# EAGLE design Blueberry Pi 7.1 (EAGLE 6.4)

## Sheet 1 of 5: IO / LRADC / RTL8237BS / Touch / SPI Flash
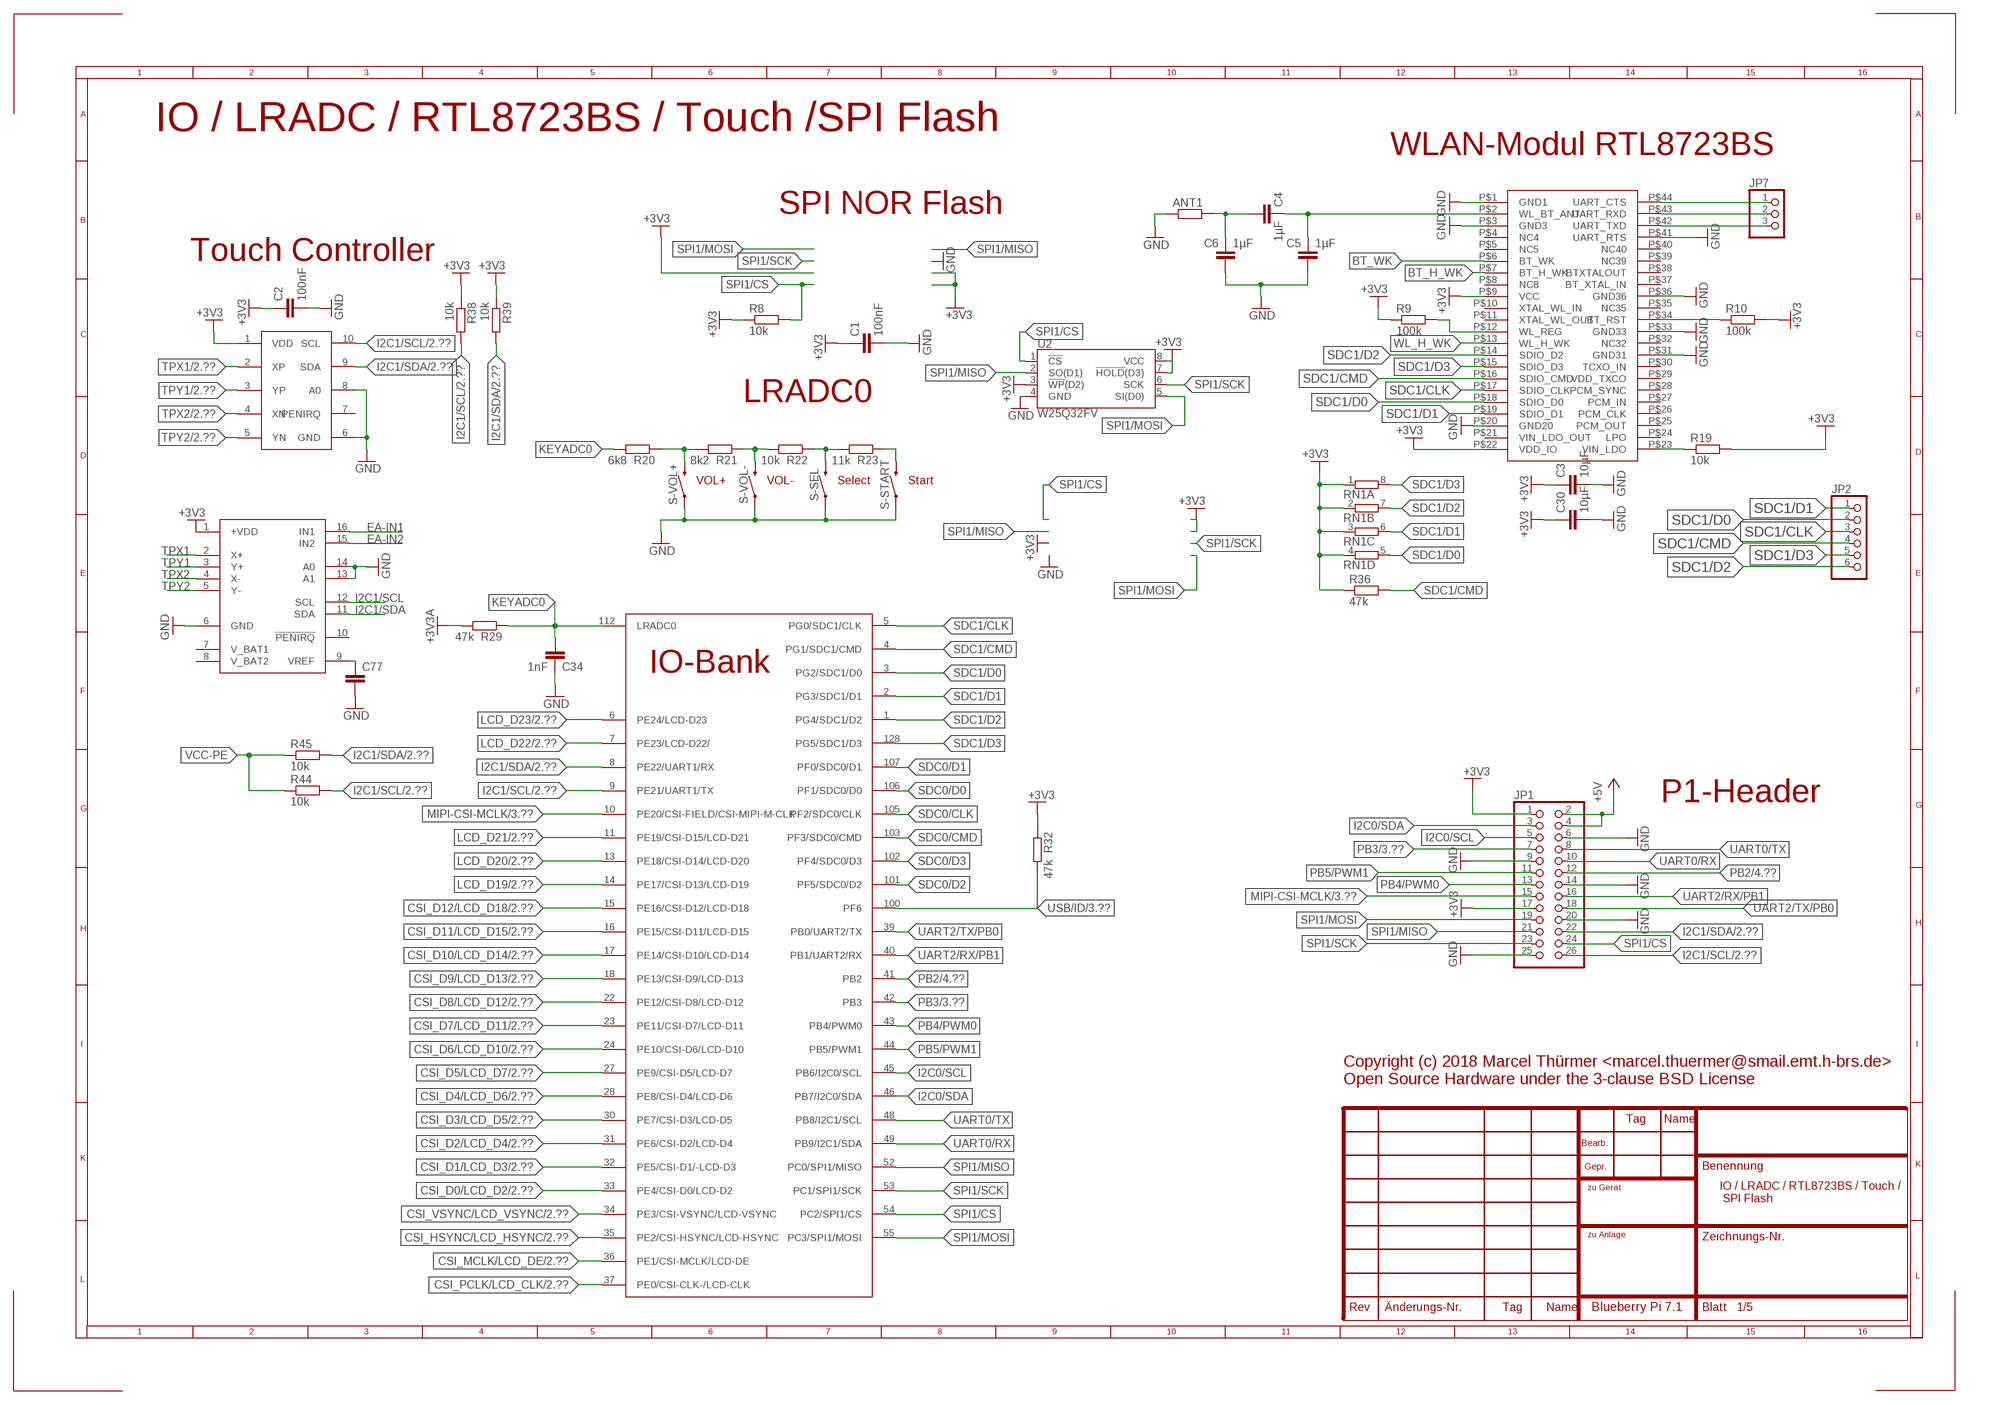
[diagram p0: schematic, sheet 1]

### Parts
ANT1  R-EU_R1206  [R1206]
C1  100nF  C-EUC0603  [C0603]
C2  100nF  C-EUC0603  [C0603]
C3  10µF  C-EUC0805  [C0805]
C4  1µF  C-EUC0603  [C0603]
C5  1µF  C-EUC0603  [C0603]
C6  1µF  C-EUC0603  [C0603]
C30  10µF  C-EUC0805  [C0805]
C34  1nF  C-EUC0603  [C0603]
C77  C-EUC0805  [C0805]
JP1  PINHD-2X13  [2X13]
JP2  PINHD-1X6_2.00  [1X06M]
JP7  PINHD-1X3M  [1X03M]
R8  10k  R-EU_R0603  [R0603]
R9  100k  R-EU_R0603  [R0603]
R10  100k  R-EU_R0603  [R0603]
R19  10k  R-EU_R0603  [R0603]
R20  6k8  R-EU_R0603  [R0603]
R21  8k2  R-EU_R0603  [R0603]
R22  10k  R-EU_R0603  [R0603]
R23  11k  R-EU_R0603  [R0603]
R29  47k  R-EU_R0603  [R0603]
R32  47k  R-EU_R0603  [R0603]
R36  47k  R-EU_R0603  [R0603]
R38  10k  R-EU_R0603  [R0603]
R39  10k  R-EU_R0603  [R0603]
R44  10k  R-EU_R0603  [R0603]
R45  10k  R-EU_R0603  [R0603]
RN1  4R-NEXB38V  [EXB38V]
S-SEL  SPARKFUN-SWITCHES_MOMENTARY-SWITCH-SPST-SMD-5.2-REDUNDANT  [SPARKFUN-SWITCHES_TACTILE_SWITCH_SMD_5.2MM]
S-START  SPARKFUN-SWITCHES_MOMENTARY-SWITCH-SPST-SMD-5.2-REDUNDANT  [SPARKFUN-SWITCHES_TACTILE_SWITCH_SMD_5.2MM]
S-VOL+  SPARKFUN-SWITCHES_MOMENTARY-SWITCH-SPST-SMD-5.2-REDUNDANT  [SPARKFUN-SWITCHES_TACTILE_SWITCH_SMD_5.2MM]
S-VOL-  SPARKFUN-SWITCHES_MOMENTARY-SWITCH-SPST-SMD-5.2-REDUNDANT  [SPARKFUN-SWITCHES_TACTILE_SWITCH_SMD_5.2MM]
U2  W25Q32FV  W25Q32FVSS  [SOIC-8]
U$1  V3S  [QFP-128]
U$2  RTL8723BS  [LGA]
U$7  TSC2003  [TSSOP16]
U$8  NS2009  [MSOP10]

### Nets
+3V3: C1.1 C2.1 C3.1 C30.1 JP1.1 JP1.17 R8.1 R9.1 R10.2 R19.2 R32.1 R36.1 R38.1 R39.1 RN1.1 RN1.2 RN1.3 RN1.4 U2.3(!WP!(D2)) U2.7(!HOLD!(D3)) U2.8(VCC) U$2.P$9(VCC) U$2.P$22(VDD_IO) U$7.1(+VDD) U$8.1(VDD) ; also sheet 2,3,4,5
+3V3A: R29.2 ; also sheet 3,4
+5V: JP1.2 JP1.4 ; also sheet 2,3,4
BT_H_WK: U$2.P$7(BT_H_WK)
BT_WK: U$2.P$6(BT_WK)
CSI_D0/LCD_D2: U$1.33(PE4/CSI-D0/LCD-D2) ; also sheet 2,5
CSI_D1/LCD_D3: U$1.32(PE5/CSI-D1/-LCD-D3) ; also sheet 2,5
CSI_D2/LCD_D4: U$1.31(PE6/CSI-D2/LCD-D4) ; also sheet 2,5
CSI_D3/LCD_D5: U$1.30(PE7/CSI-D3/LCD-D5) ; also sheet 2,5
CSI_D4/LCD_D6: U$1.28(PE8/CSI-D4/LCD-D6) ; also sheet 2,5
CSI_D5/LCD_D7: U$1.27(PE9/CSI-D5/LCD-D7) ; also sheet 2,5
CSI_D6/LCD_D10: U$1.24(PE10/CSI-D6/LCD-D10) ; also sheet 2,5
CSI_D7/LCD_D11: U$1.23(PE11/CSI-D7/LCD-D11) ; also sheet 2,5
CSI_D8/LCD_D12: U$1.22(PE12/CSI-D8/LCD-D12) ; also sheet 2,5
CSI_D9/LCD_D13: U$1.18(PE13/CSI-D9/LCD-D13) ; also sheet 2,5
CSI_D10/LCD_D14: U$1.17(PE14/CSI-D10/LCD-D14) ; also sheet 2,5
CSI_D11/LCD_D15: U$1.16(PE15/CSI-D11/LCD-D15) ; also sheet 2,5
CSI_D12/LCD_D18: U$1.15(PE16/CSI-D12/LCD-D18) ; also sheet 2,5
CSI_HSYNC/LCD_HSYNC: U$1.35(PE2/CSI-HSYNC/LCD-HSYNC) ; also sheet 2,5
CSI_MCLK/LCD_DE: U$1.36(PE1/CSI-MCLK/LCD-DE) ; also sheet 2,5
CSI_PCLK/LCD_CLK: U$1.37(PE0/CSI-CLK-/LCD-CLK) ; also sheet 2,5
CSI_VSYNC/LCD_VSYNC: U$1.34(PE3/CSI-VSYNC/LCD-VSYNC) ; also sheet 2,5
EA-IN1: U$7.16(IN1) ; also sheet 2
EA-IN2: U$7.15(IN2) ; also sheet 2
GND: ANT1.1 C1.2 C2.2 C3.2 C5.2 C6.2 C30.2 C34.1 C77.2 JP1.6 JP1.9 JP1.14 JP1.20 JP1.25 S-SEL.1 S-SEL.2 S-START.1 S-START.2 S-VOL+.1 S-VOL+.2 S-VOL-.1 S-VOL-.2 U2.4(GND) U$2.P$1(GND1) U$2.P$3(GND3) U$2.P$20(GND20) U$2.P$31(GND31) U$2.P$33(GND33) U$2.P$36(GND36) U$2.P$41(UART_RTS) U$7.6(GND) U$7.13(A1) U$7.14(A0) U$8.6(GND) U$8.8(A0) ; also sheet 2,3,4,5
I2C0/SCL: JP1.5 U$1.45(PB6/I2C0/SCL)
I2C0/SDA: JP1.3 U$1.46(PB7/I2C0/SDA)
I2C1/SCL: JP1.26 R38.2 R44.2 U$1.9(PE21/UART1/TX) U$7.12(SCL) U$8.10(SCL) ; also sheet 2,3
I2C1/SDA: JP1.22 R39.2 R45.2 U$1.8(PE22/UART1/RX) U$7.11(SDA) U$8.9(SDA) ; also sheet 2,3
KEYADC0: C34.2 R20.2 R29.1 U$1.112(LRADC0)
LCD_D19: U$1.14(PE17/CSI-D13/LCD-D19) ; also sheet 2,5
LCD_D20: U$1.13(PE18/CSI-D14/LCD-D20) ; also sheet 2,5
LCD_D21: U$1.11(PE19/CSI-D15/LCD-D21) ; also sheet 2,5
LCD_D22: U$1.7(PE23/LCD-D22/) ; also sheet 2,5
LCD_D23: U$1.6(PE24/LCD-D23) ; also sheet 2,5
MIPI-CSI-MCLK: JP1.15 U$1.10(PE20/CSI-FIELD/CSI-MIPI-M-CLK) ; also sheet 3
N$4: R19.1 U$2.P$23(VIN_LDO)
N$7: R9.2 U$2.P$12(WL_REG)
N$8: R20.1 R21.2 S-VOL+.3 S-VOL+.4
N$11: C77.1 U$7.9(VREF)
N$12: R10.1 U$2.P$34(BT_RST)
N$13: C4.1 C5.1 U$2.P$2(WL_BT_ANT)
N$14: ANT1.2 C4.2 C6.1
N$41: R21.1 R22.2 S-VOL-.3 S-VOL-.4
N$42: R22.1 R23.2 S-SEL.3 S-SEL.4
N$43: R23.1 S-START.3 S-START.4
N$61: JP7.1 U$2.P$44(UART_CTS)
N$62: JP7.2 U$2.P$43(UART_RXD)
N$63: JP7.3 U$2.P$42(UART_TXD)
PB2: JP1.12 U$1.41(PB2) ; also sheet 4
PB3: JP1.7 U$1.42(PB3) ; also sheet 3
PB4/PWM0: JP1.13 U$1.43(PB4/PWM0)
PB5/PWM1: JP1.11 U$1.44(PB5/PWM1)
SDC0/CLK: U$1.105(PF2/SDC0/CLK) ; also sheet 3
SDC0/CMD: U$1.103(PF3/SDC0/CMD) ; also sheet 3
SDC0/D0: U$1.106(PF1/SDC0/D0) ; also sheet 3
SDC0/D1: U$1.107(PF0/SDC0/D1) ; also sheet 3
SDC0/D2: U$1.101(PF5/SDC0/D2) ; also sheet 3
SDC0/D3: U$1.102(PF4/SDC0/D3) ; also sheet 3
SDC1/CLK: JP2.3 U$1.5(PG0/SDC1/CLK) U$2.P$17(SDIO_CLK)
SDC1/CMD: JP2.4 R36.2 U$1.4(PG1/SDC1/CMD) U$2.P$16(SDIO_CMD)
SDC1/D0: JP2.2 RN1.5 U$1.3(PG2/SDC1/D0) U$2.P$18(SDIO_D0)
SDC1/D1: JP2.1 RN1.6 U$1.2(PG3/SDC1/D1) U$2.P$19(SDIO_D1)
SDC1/D2: JP2.6 RN1.7 U$1.1(PG4/SDC1/D2) U$2.P$14(SDIO_D2)
SDC1/D3: JP2.5 RN1.8 U$1.128(PG5/SDC1/D3) U$2.P$15(SDIO_D3)
SPI1/CS: JP1.24 R8.2 U2.1(!CS!) U$1.54(PC2/SPI1/CS)
SPI1/MISO: JP1.21 U2.2(SO(D1)) U$1.52(PC0/SPI1/MISO)
SPI1/MOSI: JP1.19 U2.5(SI(D0)) U$1.55(PC3/SPI1/MOSI)
SPI1/SCK: JP1.23 U2.6(SCK) U$1.53(PC1/SPI1/SCK)
TPX1: U$7.2(X+) U$8.2(XP) ; also sheet 2
TPX2: U$7.4(X-) U$8.4(XN) ; also sheet 2
TPY1: U$7.3(Y+) U$8.3(YP) ; also sheet 2
TPY2: U$7.5(Y-) U$8.5(YN) ; also sheet 2
UART0/RX: JP1.10 U$1.49(PB9/I2C1/SDA)
UART0/TX: JP1.8 U$1.48(PB8/I2C1/SCL)
UART2/RX/PB1: JP1.16 U$1.40(PB1/UART2/RX)
UART2/TX/PB0: JP1.18 U$1.39(PB0/UART2/TX)
USB/ID: R32.2 U$1.100(PF6) ; also sheet 3
VCC-PE: R44.1 R45.1 ; also sheet 4
WL_H_WK: U$2.P$13(WL_H_WK)
Unconnected: U$2.P$4(NC4) U$2.P$5(NC5) U$2.P$8(NC8) U$2.P$10(XTAL_WL_IN) U$2.P$11(XTAL_WL_OUT) U$2.P$21(VIN_LDO_OUT) U$2.P$24(LPO) U$2.P$25(PCM_OUT) U$2.P$26(PCM_CLK) U$2.P$27(PCM_IN) U$2.P$28(PCM_SYNC) U$2.P$29(VDD_TXCO) U$2.P$30(TCXO_IN) U$2.P$32(NC32) U$2.P$35(NC35) U$2.P$37(BT_XTAL_IN) U$2.P$38(BTXTALOUT) U$2.P$39(NC39) U$2.P$40(NC40) U$7.7(V_BAT1) U$7.8(V_BAT2) U$7.10(!PENIRQ) U$8.7(PENIRQ)

### Notes on the sheet
- IO / LRADC / RTL8723BS / Touch /SPI Flash
- WLAN-Modul RTL8723BS
- SPI NOR Flash
- Touch Controller
- LRADC0
- VOL+ | VOL- | Select | Start
- P1-Header
- Copyright (c) 2018 Marcel Thürmer <marcel.thuermer@smail.emt.h-brs.de>
  Open Source Hardware under the 3-clause BSD License
- IO / LRADC / RTL8723BS / Touch /
   SPI Flash

## Sheet 2 of 5: LCD FFC / Camera FFC / Camera Header (OV7670, OV2640)
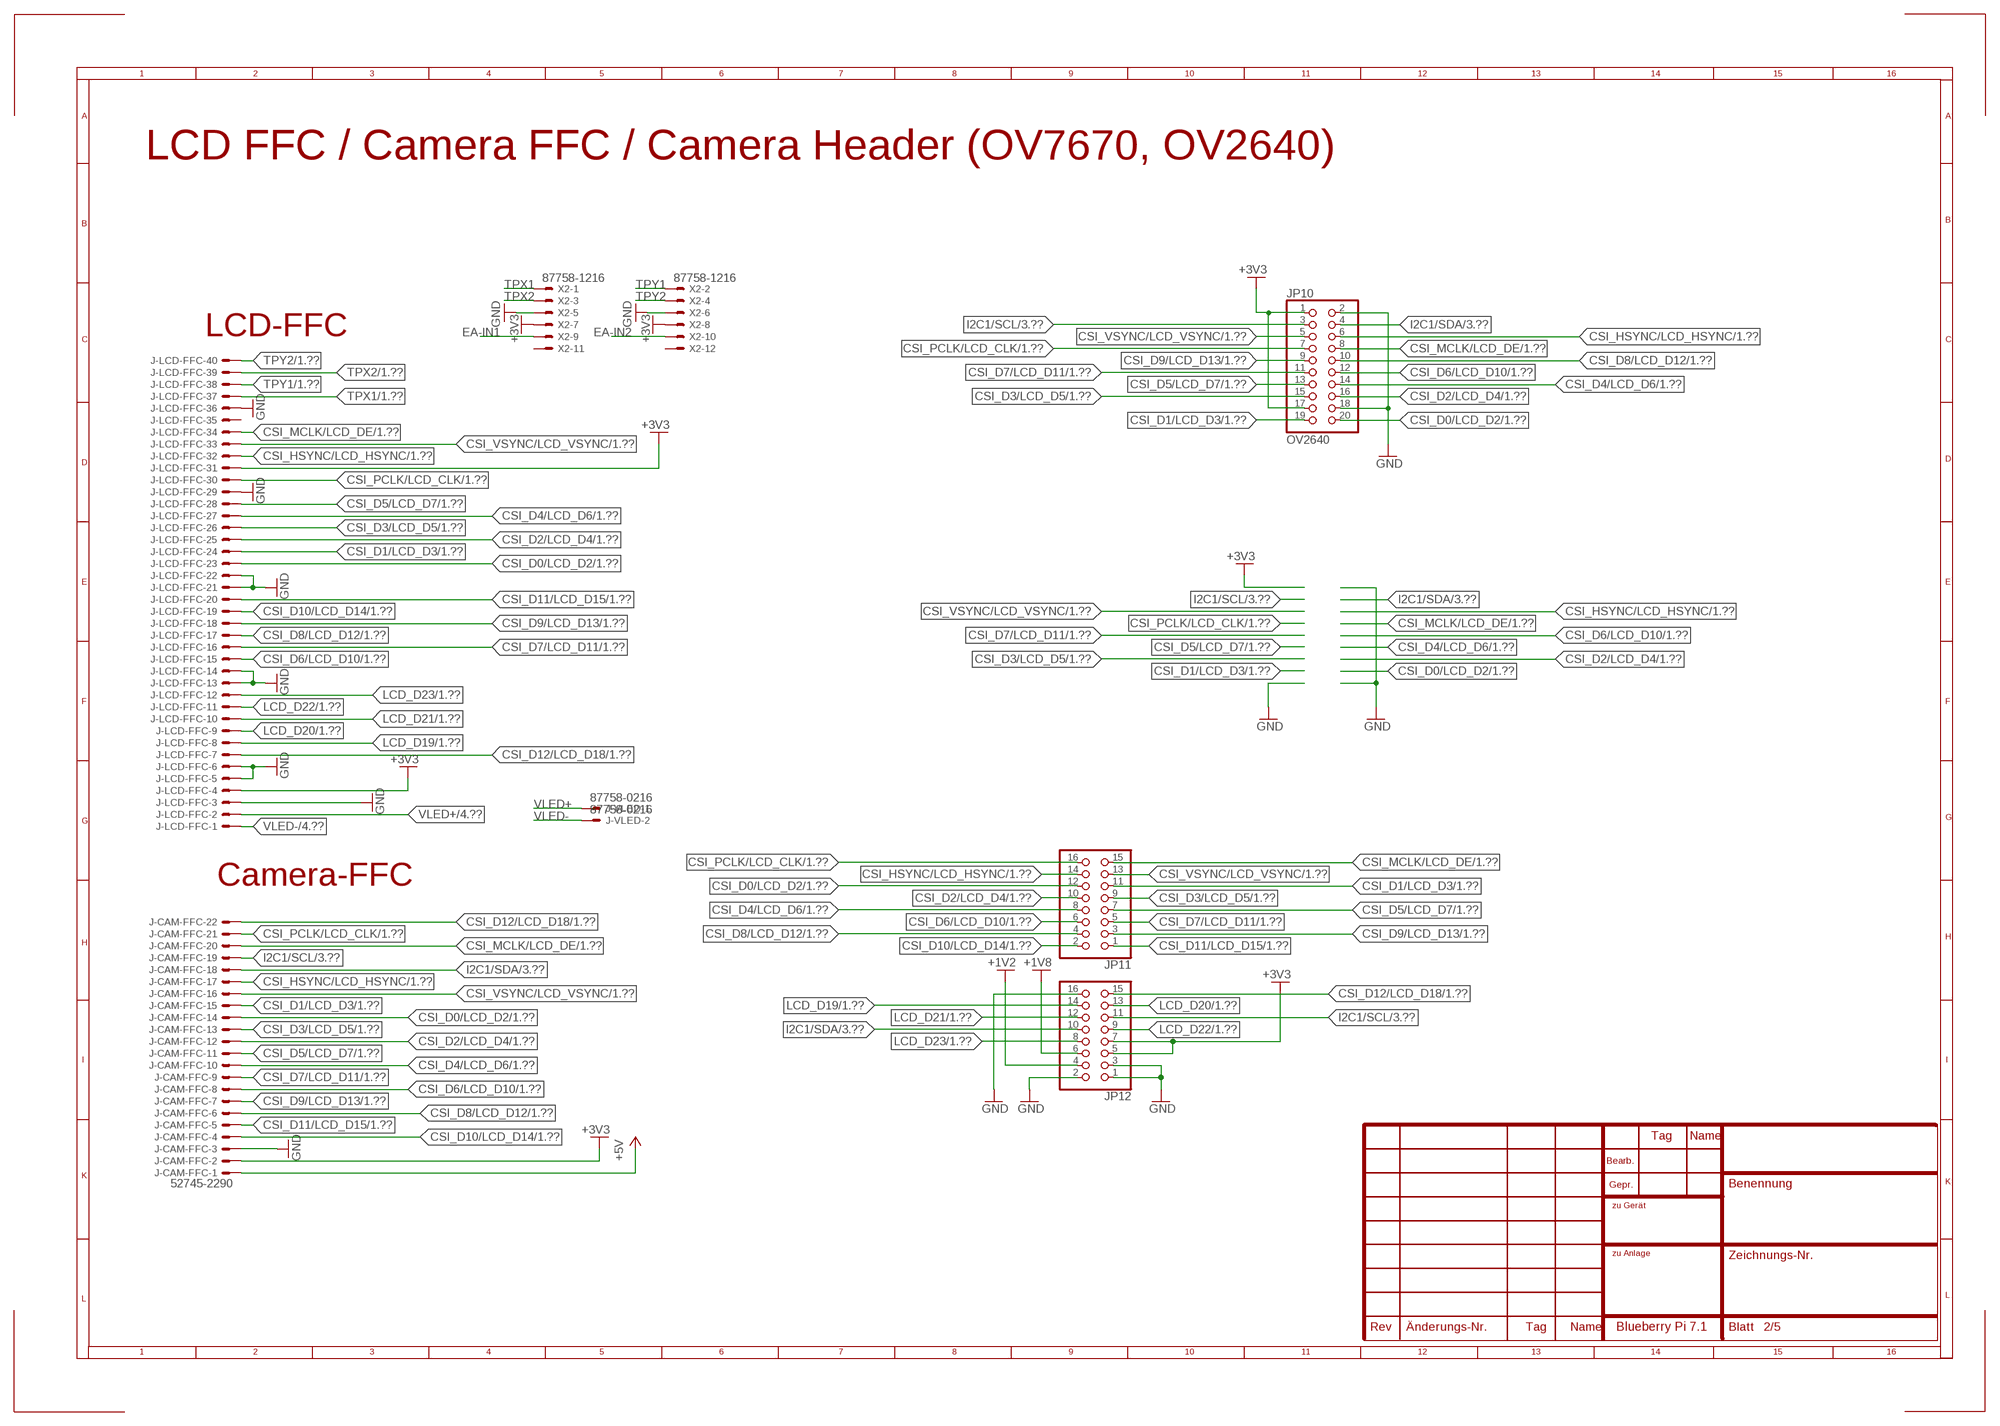
[diagram p1: schematic, sheet 2]

### Parts
J-CAM-FFC  52745-2290  [52745-2290]
J-LCD-FFC  40PINFPCH15-1LW  [XF2H-4015-1LW]
J-VLED  87758-0216  [87758-0216]
JP10  OV2640  PINHD-2X10  [2X10]
JP11  PINHD-2X8M  [2X08M]
JP12  PINHD-2X8M  [2X08M]
X2  87758-1216  [87758-1216]

### Nets
+1V2: JP12.4 ; also sheet 4
+1V8: JP12.6 ; also sheet 4
+3V3: J-CAM-FFC.2 J-LCD-FFC.4 J-LCD-FFC.31 JP10.1 JP10.17 JP12.5 JP12.7 X2.7 X2.8 ; also sheet 1,3,4,5
+5V: J-CAM-FFC.1 ; also sheet 1,3,4
CSI_D0/LCD_D2: J-CAM-FFC.14 J-LCD-FFC.23 JP10.20 JP11.12 ; also sheet 1,5
CSI_D1/LCD_D3: J-CAM-FFC.15 J-LCD-FFC.24 JP10.19 JP11.11 ; also sheet 1,5
CSI_D2/LCD_D4: J-CAM-FFC.12 J-LCD-FFC.25 JP10.16 JP11.10 ; also sheet 1,5
CSI_D3/LCD_D5: J-CAM-FFC.13 J-LCD-FFC.26 JP10.15 JP11.9 ; also sheet 1,5
CSI_D4/LCD_D6: J-CAM-FFC.10 J-LCD-FFC.27 JP10.14 JP11.8 ; also sheet 1,5
CSI_D5/LCD_D7: J-CAM-FFC.11 J-LCD-FFC.28 JP10.13 JP11.7 ; also sheet 1,5
CSI_D6/LCD_D10: J-CAM-FFC.8 J-LCD-FFC.15 JP10.12 JP11.6 ; also sheet 1,5
CSI_D7/LCD_D11: J-CAM-FFC.9 J-LCD-FFC.16 JP10.11 JP11.5 ; also sheet 1,5
CSI_D8/LCD_D12: J-CAM-FFC.6 J-LCD-FFC.17 JP10.10 JP11.4 ; also sheet 1,5
CSI_D9/LCD_D13: J-CAM-FFC.7 J-LCD-FFC.18 JP10.9 JP11.3 ; also sheet 1,5
CSI_D10/LCD_D14: J-CAM-FFC.4 J-LCD-FFC.19 JP11.2 ; also sheet 1,5
CSI_D11/LCD_D15: J-CAM-FFC.5 J-LCD-FFC.20 JP11.1 ; also sheet 1,5
CSI_D12/LCD_D18: J-CAM-FFC.22 J-LCD-FFC.7 JP12.15 ; also sheet 1,5
CSI_HSYNC/LCD_HSYNC: J-CAM-FFC.17 J-LCD-FFC.32 JP10.6 JP11.14 ; also sheet 1,5
CSI_MCLK/LCD_DE: J-CAM-FFC.20 J-LCD-FFC.34 JP10.8 JP11.15 ; also sheet 1,5
CSI_PCLK/LCD_CLK: J-CAM-FFC.21 J-LCD-FFC.30 JP10.7 JP11.16 ; also sheet 1,5
CSI_VSYNC/LCD_VSYNC: J-CAM-FFC.16 J-LCD-FFC.33 JP10.5 JP11.13 ; also sheet 1,5
EA-IN1: X2.9 ; also sheet 1
EA-IN2: X2.10 ; also sheet 1
GND: J-CAM-FFC.3 J-LCD-FFC.3 J-LCD-FFC.5 J-LCD-FFC.6 J-LCD-FFC.13 J-LCD-FFC.14 J-LCD-FFC.21 J-LCD-FFC.22 J-LCD-FFC.29 J-LCD-FFC.36 JP10.2 JP10.18 JP12.1 JP12.2 JP12.3 JP12.16 X2.5 X2.6 ; also sheet 1,3,4,5
I2C1/SCL: J-CAM-FFC.19 JP10.3 JP12.11 ; also sheet 1,3
I2C1/SDA: J-CAM-FFC.18 JP10.4 JP12.10 ; also sheet 1,3
LCD_D19: J-LCD-FFC.8 JP12.14 ; also sheet 1,5
LCD_D20: J-LCD-FFC.9 JP12.13 ; also sheet 1,5
LCD_D21: J-LCD-FFC.10 JP12.12 ; also sheet 1,5
LCD_D22: J-LCD-FFC.11 JP12.9 ; also sheet 1,5
LCD_D23: J-LCD-FFC.12 JP12.8 ; also sheet 1,5
TPX1: J-LCD-FFC.37 X2.1 ; also sheet 1
TPX2: J-LCD-FFC.39 X2.3 ; also sheet 1
TPY1: J-LCD-FFC.38 X2.2 ; also sheet 1
TPY2: J-LCD-FFC.40 X2.4 ; also sheet 1
VLED+: J-LCD-FFC.2 J-VLED.1 ; also sheet 4
VLED-: J-LCD-FFC.1 J-VLED.2 ; also sheet 4
Unconnected: J-LCD-FFC.35 X2.11 X2.12

### Notes on the sheet
- LCD FFC / Camera FFC / Camera Header (OV7670, OV2640)
- LCD-FFC
- Camera-FFC

## Sheet 3 of 5: Ethernet / USB Host / SDC0 / Audio / MIPI CSI
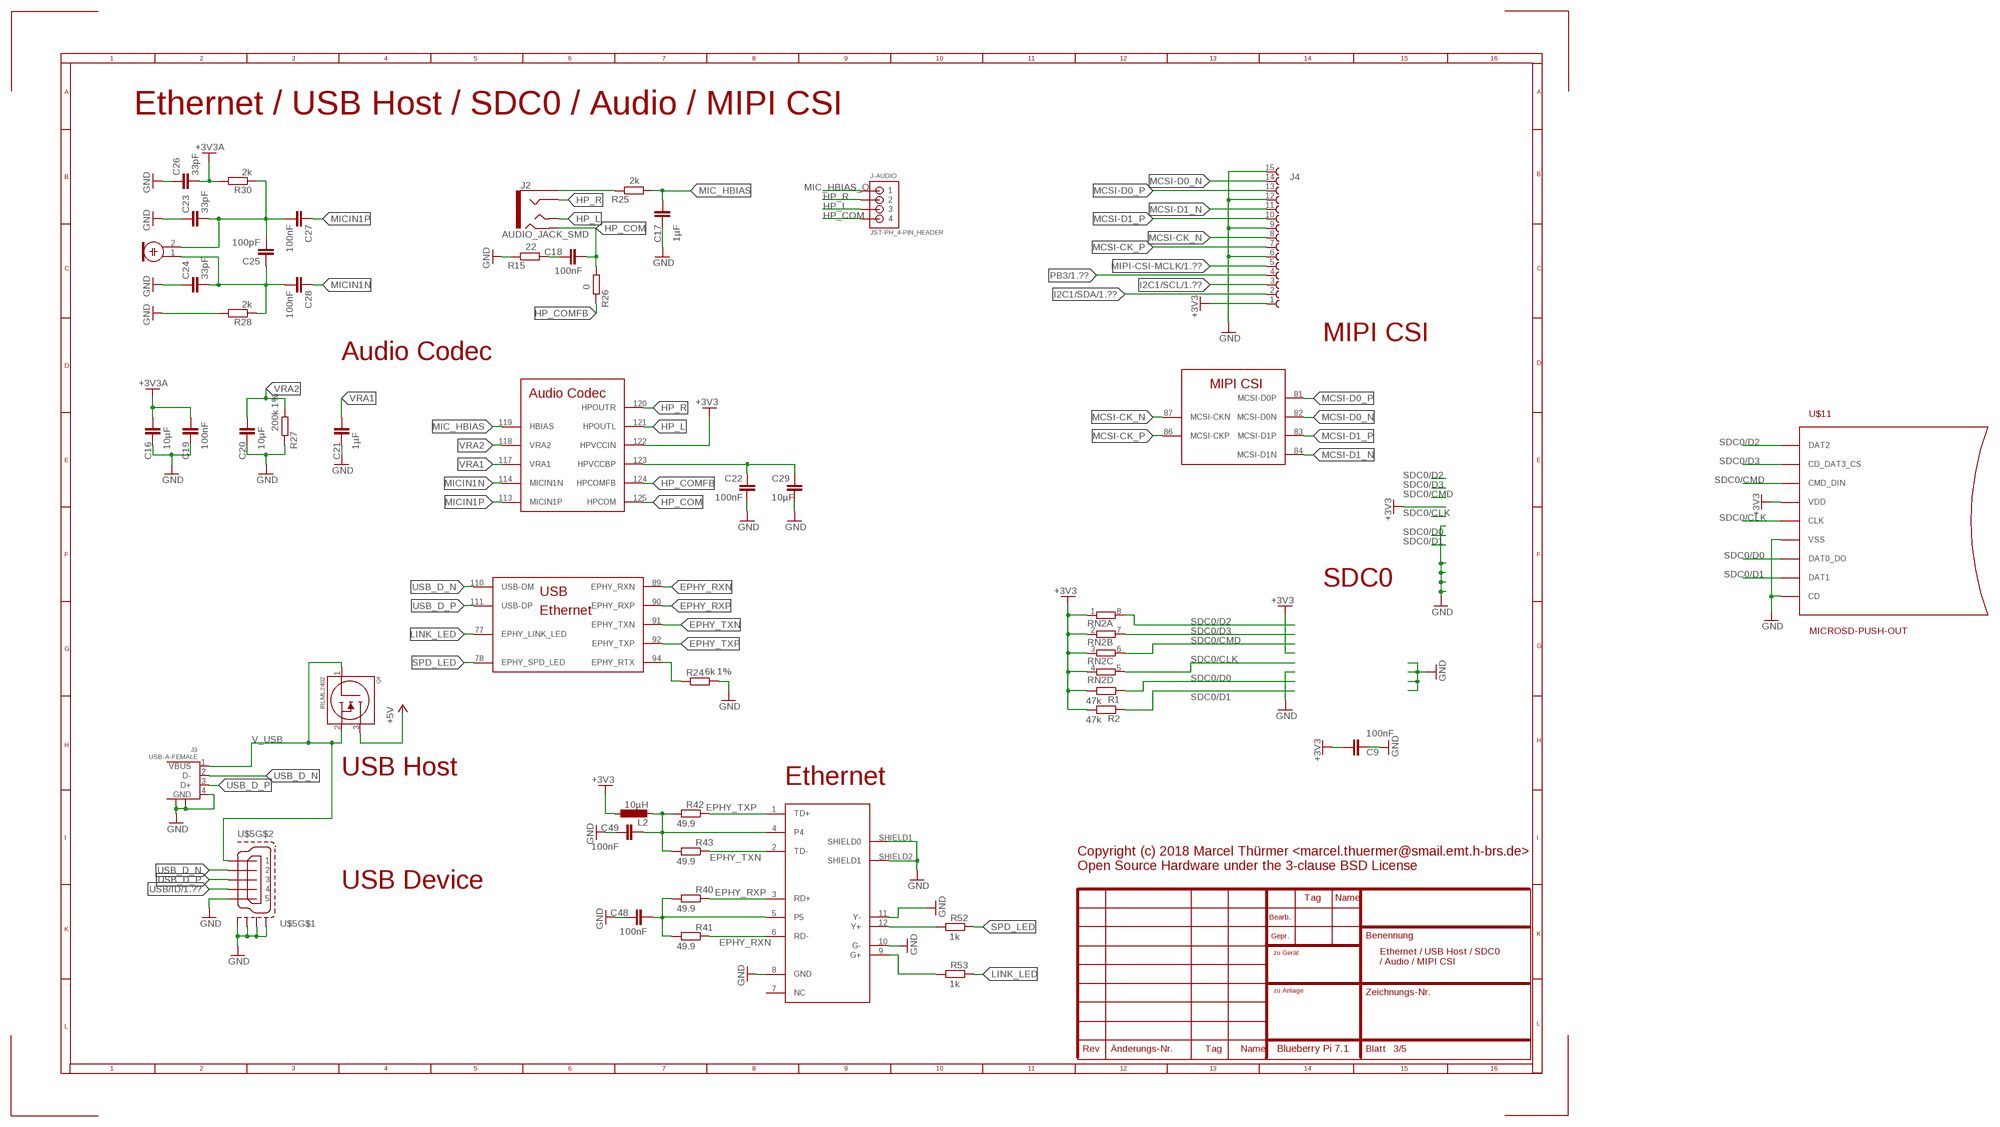
[diagram p2: schematic, sheet 3]

### Parts
C9  100nF  C-EUC0603  [C0603]
C16  10µF  C-EUC0805  [C0805]
C17  1µF  C-EUC0603  [C0603]
C18  100nF  C-EUC0603  [C0603]
C19  100nF  C-EUC0603  [C0603]
C20  10µF  C-EUC0805  [C0805]
C21  1µF  C-EUC0603  [C0603]
C22  100nF  C-EUC0603  [C0603]
C23  33pF  C-EUC0603  [C0603]
C24  33pF  C-EUC0603  [C0603]
C25  100pF  C-EUC0603  [C0603]
C26  33pF  C-EUC0603  [C0603]
C27  100nF  C-EUC0603  [C0603]
C28  100nF  C-EUC0603  [C0603]
C29  10µF  C-EUC0805  [C0805]
C48  100nF  C-EUC0603  [C0603]
C49  100nF  C-EUC0603  [C0603]
J2  AUDIO_JACK_SMD  AUDIO_JACK_TRRSSMD_RA  [AUDIO_JACK_3.5MM_TRRS_SMD_RA]
J3  USB-A-FEMALE  [USB-A-FEMALE]
J4  68611514122  [68611514122]
J-AUDIO  JST-PH_4-PIN_HEADER  [JST_B4B-PH_HEADER]
L2  10µH  L-EUL0805  [L0805]
MIC  ELECTRET_MICROPHON-F6035AP  [F6035AP]
Q4  IRLML2402  [SOT23]
R1  47k  R-EU_R0603  [R0603]
R2  47k  R-EU_R0603  [R0603]
R15  22  R-EU_R0603  [R0603]
R24  6k 1%  R-EU_R0603  [R0603]
R25  2k  R-EU_R0603  [R0603]
R26  0  R-EU_R0603  [R0603]
R27  200k 1%  R-EU_R0603  [R0603]
R28  2k  R-EU_R0603  [R0603]
R30  2k  R-EU_R0603  [R0603]
R40  49.9  R-EU_R0603  [R0603]
R41  49.9  R-EU_R0603  [R0603]
R42  49.9  R-EU_R0603  [R0603]
R43  49.9  R-EU_R0603  [R0603]
R52  1k  R-EU_R0603  [R0603]
R53  1k  R-EU_R0603  [R0603]
RN2  4R-NEXB38V  [EXB38V]
U$3  HR911105A  [RJ45]
U$5  MICRO-USB-SHIELD-ZX62R-B-5P  [ZX62R-B-5P]
U$11  MICROSD-PUSH-OUT  [MICROSD-PUSH-OUT]

### Nets
+3V3: C9.1 J4.1 L2.1 R1.2 R2.2 RN2.1 RN2.2 RN2.3 RN2.4 U$1.122(HPVCCIN) U$11.4(VDD) ; also sheet 1,2,4,5
+3V3A: C16.2 C19.2 C26.2 R30.2 ; also sheet 1,4
+5V: Q4.3(DRAIN) ; also sheet 1,2,4
EPHY_RXN: R41.1 U$1.89(EPHY_RXN) U$3.6(RD-)
EPHY_RXP: R40.1 U$1.90(EPHY_RXP) U$3.3(RD+)
EPHY_TXN: R43.1 U$1.91(EPHY_TXN) U$3.2(TD-)
EPHY_TXP: R42.1 U$1.92(EPHY_TXP) U$3.1(TD+)
GND: C9.2 C16.1 C17.2 C19.1 C20.1 C21.1 C22.2 C23.1 C24.1 C26.1 C29.1 C48.2 C49.2 J3.4(GND) J3.P$1 J3.P$2 J4.6 J4.9 J4.12 J4.15 R15.1 R24.2 R27.1 R28.2 U$3.8(GND) U$3.10(G-) U$3.11(Y-) U$3.SHIELD1(SHIELD0) U$3.SHIELD2(SHIELD1) U$5.5 U$5.M1(S1) U$5.M2(S2) U$5.M3(S3) U$5.M4(S4) U$11.6(VSS) U$11.CD U$11.G1(VSS) U$11.G2(VSS) U$11.G3(VSS) U$11.G4(VSS) ; also sheet 1,2,4,5
HP_COM: C18.2 J2.RING2 J-AUDIO.P4 R26.2 U$1.125(HPCOM)
HP_COMFB: R26.1 U$1.124(HPCOMFB)
HP_L: J2.TIP J-AUDIO.P3 U$1.121(HPOUTL)
HP_R: J2.RING1 J-AUDIO.P2 U$1.120(HPOUTR)
I2C1/SCL: J4.3 ; also sheet 1,2
I2C1/SDA: J4.2 ; also sheet 1,2
LINK_LED: R53.1 U$1.77(EPHY_LINK_LED)
MCSI-CK_N: J4.8 U$1.87(MCSI-CKN)
MCSI-CK_P: J4.7 U$1.86(MCSI-CKP)
MCSI-D0_N: J4.14 U$1.82(MCSI-D0N)
MCSI-D0_P: J4.13 U$1.81(MCSI-D0P)
MCSI-D1_N: J4.11 U$1.84(MCSI-D1N)
MCSI-D1_P: J4.10 U$1.83(MCSI-D1P)
MIC_HBIAS: C17.1 R25.2 U$1.119(HBIAS)
MIC_HBIAS_O: J2.EARTH J-AUDIO.P1 R25.1
MICIN1N: C28.1 U$1.114(MICIN1N)
MICIN1P: C27.1 U$1.113(MICIN1P)
MIPI-CSI-MCLK: J4.5 ; also sheet 1
N$1: R24.1 U$1.94(EPHY_RTX)
N$18: R53.2 U$3.9(G+)
N$20: R52.2 U$3.12(Y+)
N$21: C49.1 L2.2 R42.2 R43.2 U$3.4
N$22: C48.1 R40.2 R41.2 U$3.5
N$28: C22.1 C29.2 U$1.123(HPVCCBP)
N$47: C18.1 R15.2
N$48: C23.2 C25.2 C27.2 MIC.2 R30.1
N$49: C24.2 C25.1 C28.2 MIC.1 R28.1
PB3: J4.4 ; also sheet 1
SDC0/CLK: RN2.5 U$11.5(CLK) ; also sheet 1
SDC0/CMD: RN2.6 U$11.3(CMD_DIN) ; also sheet 1
SDC0/D0: R1.1 U$11.7(DAT0_DO) ; also sheet 1
SDC0/D1: R2.1 U$11.8(DAT1) ; also sheet 1
SDC0/D2: RN2.8 U$11.1(DAT2) ; also sheet 1
SDC0/D3: RN2.7 U$11.2(CD_DAT3_CS) ; also sheet 1
SPD_LED: R52.1 U$1.78(EPHY_SPD_LED)
USB/ID: U$5.4 ; also sheet 1
USB_D_N: J3.2(D-) U$1.110(USB-DM) U$5.2
USB_D_P: J3.3(D+) U$1.111(USB-DP) U$5.3
V_USB: J3.1(VBUS) Q4.1(GATE) Q4.2(SOURCE) U$5.1
VRA1: C21.2 U$1.117(VRA1)
VRA2: C20.2 R27.2 U$1.118(VRA2)
Unconnected: U$3.7(NC)

### Notes on the sheet
- Ethernet / USB Host / SDC0 / Audio / MIPI CSI
- MIPI CSI
- Audio Codec
- SDC0
- USB Host
- Ethernet
- Copyright (c) 2018 Marcel Thürmer <marcel.thuermer@smail.emt.h-brs.de>
  Open Source Hardware under the 3-clause BSD License
- USB Device
- Ethernet / USB Host / SDC0 
  / Audio / MIPI CSI

## Sheet 4 of 5: VCC / RTC / PLL
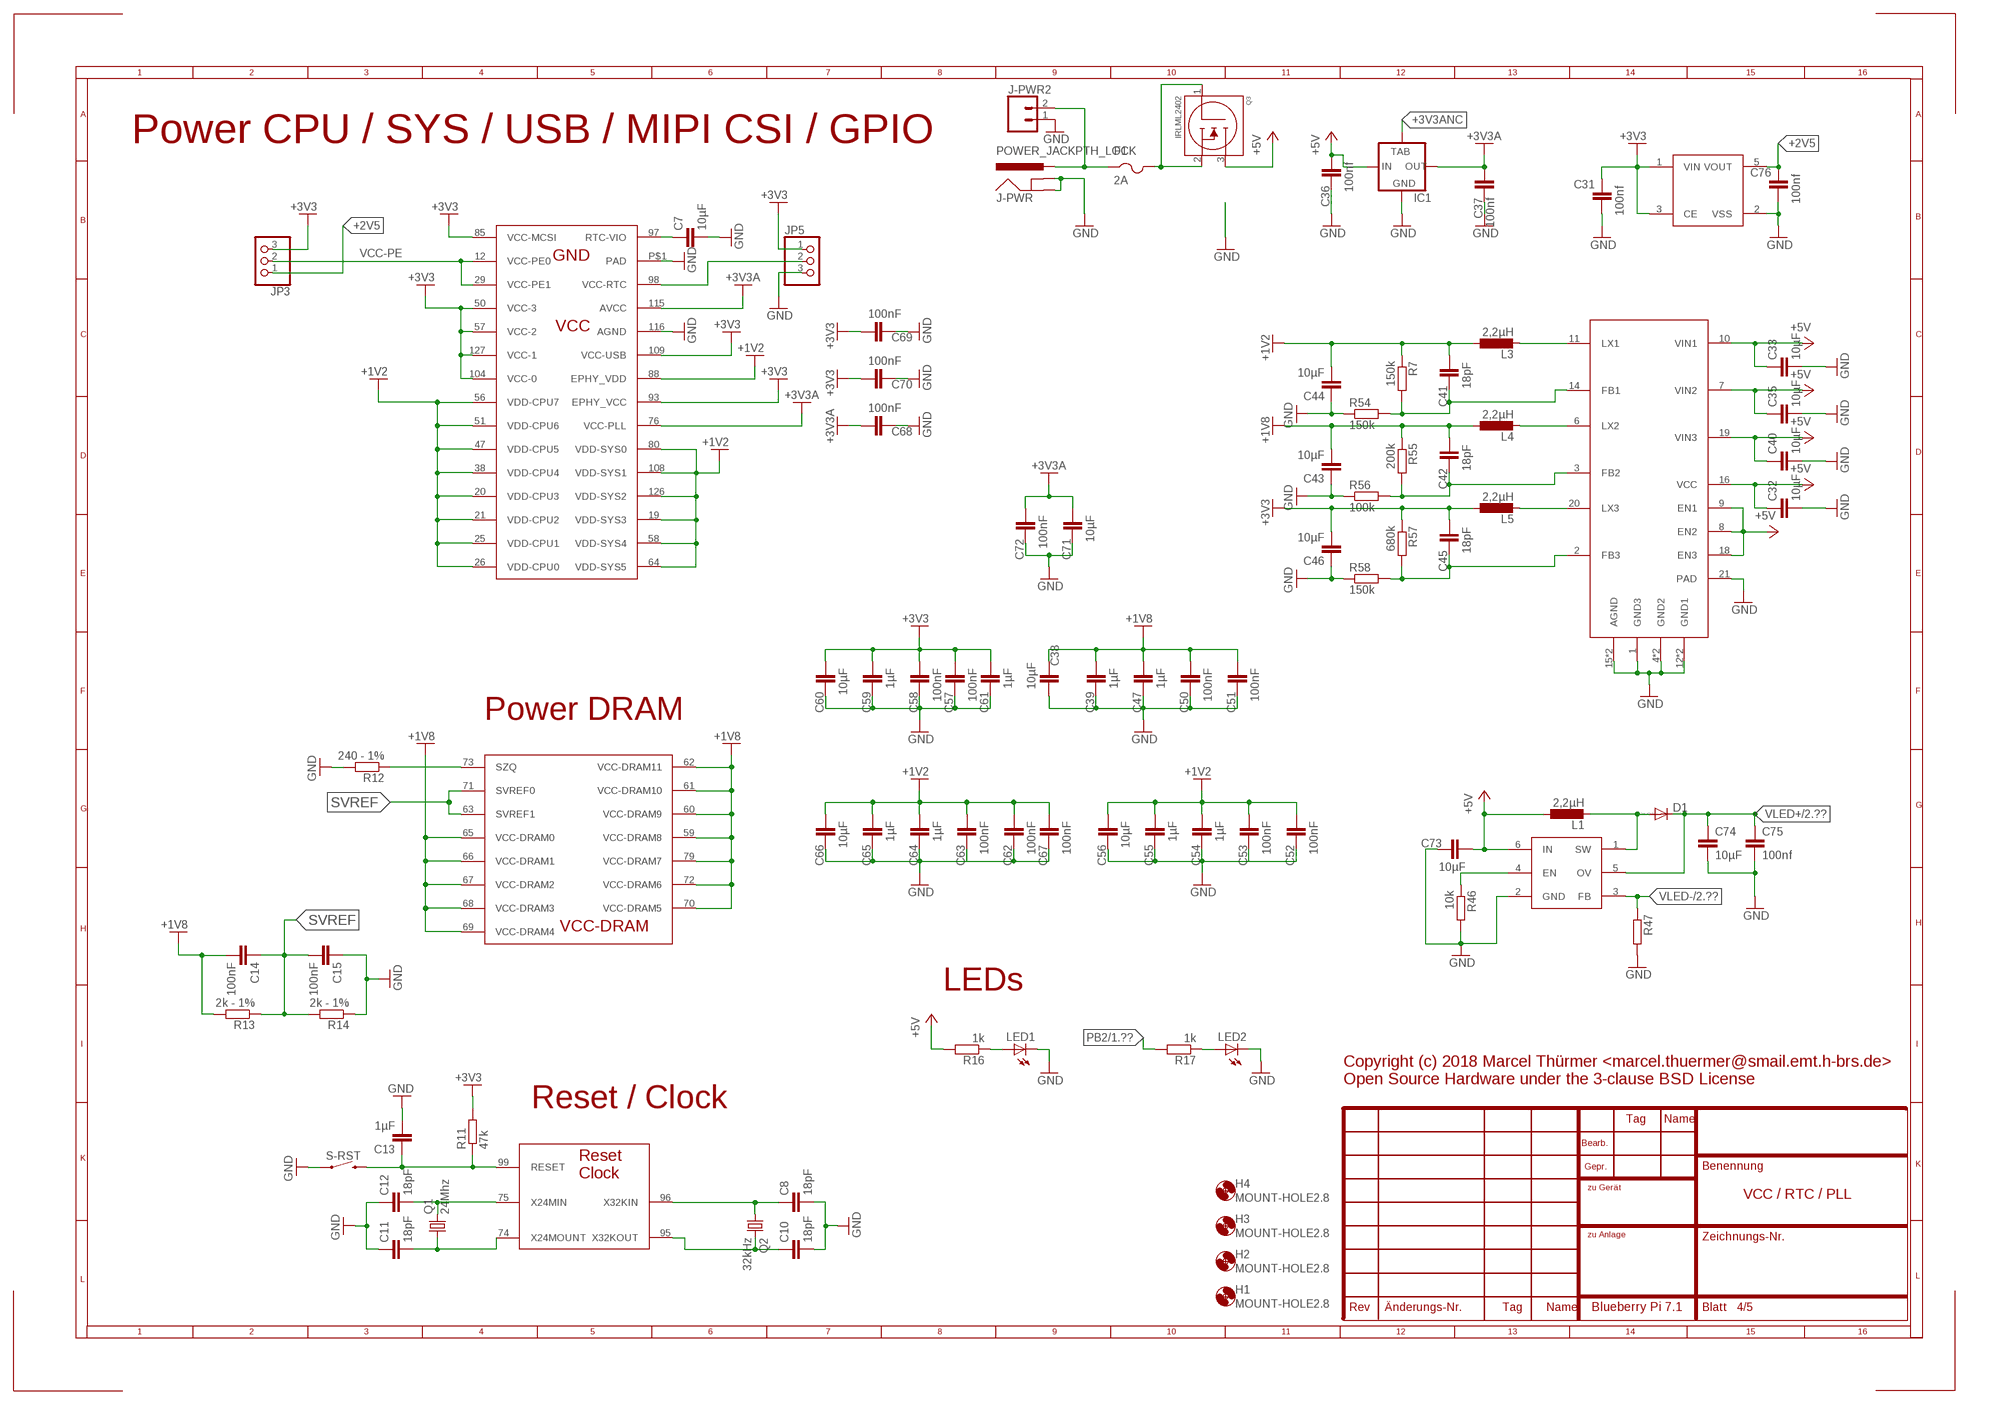
[diagram p3: schematic, sheet 4]

### Parts
C7  10µF  C-EUC0805  [C0805]
C8  18pF  C-EUC0603  [C0603]
C10  18pF  C-EUC0603  [C0603]
C11  18pF  C-EUC0603  [C0603]
C12  18pF  C-EUC0603  [C0603]
C13  1µF  C-EUC0603  [C0603]
C14  100nF  C-EUC0603  [C0603]
C15  100nF  C-EUC0603  [C0603]
C31  100nf  C-EUC0603  [C0603]
C32  10µF  C-EUC0805  [C0805]
C33  10µF  C-EUC0805  [C0805]
C35  10µF  C-EUC0805  [C0805]
C36  100nf  C-EUC0603  [C0603]
C37  100nf  C-EUC0603  [C0603]
C38  10µF  C-EUC0603  [C0603]
C39  1µF  C-EUC0603  [C0603]
C40  10µF  C-EUC0805  [C0805]
C41  18pF  C-EUC0603  [C0603]
C42  18pF  C-EUC0603  [C0603]
C43  10µF  C-EUC0805  [C0805]
C44  10µF  C-EUC0805  [C0805]
C45  18pF  C-EUC0603  [C0603]
C46  10µF  C-EUC0805  [C0805]
C47  1µF  C-EUC0603  [C0603]
C50  100nF  C-EUC0805  [C0805]
C51  100nF  C-EUC0603  [C0603]
C52  100nF  C-EUC0805  [C0805]
C53  100nF  C-EUC0603  [C0603]
C54  1µF  C-EUC0805  [C0805]
C55  1µF  C-EUC0603  [C0603]
C56  10µF  C-EUC0603  [C0603]
C57  100nF  C-EUC0603  [C0603]
C58  100nF  C-EUC0603  [C0603]
C59  1µF  C-EUC0805  [C0805]
C60  10µF  C-EUC0603  [C0603]
C61  1µF  C-EUC0805  [C0805]
C62  100nF  C-EUC0603  [C0603]
C63  100nF  C-EUC0805  [C0805]
C64  1µF  C-EUC0603  [C0603]
C65  1µF  C-EUC0603  [C0603]
C66  10µF  C-EUC0805  [C0805]
C67  100nF  C-EUC0603  [C0603]
C68  100nF  C-EUC0603  [C0603]
C69  100nF  C-EUC0805  [C0805]
C70  100nF  C-EUC0603  [C0603]
C71  10µF  C-EUC0603  [C0603]
C72  100nF  C-EUC0603  [C0603]
C73  10µF  C-EUC0805  [C0805]
C74  10µF  C-EUC0805  [C0805]
C75  100nf  C-EUC0603  [C0603]
C76  100nf  C-EUC0603  [C0603]
D1  DIODE-SOD323-W  [SOD323-W]
F1  2A  PTCFUSE-1206  [R1206]
H1  MOUNT-HOLE2.8  [2,8]
H2  MOUNT-HOLE2.8  [2,8]
H3  MOUNT-HOLE2.8  [2,8]
H4  MOUNT-HOLE2.8  [2,8]
IC1  LM1117  [SOT223]
J-PWR  POWER_JACKPTH_LOCK  [POWER_JACK_PTH_LOCK]
J-PWR2  CONN_02  [1X02]
JP3  PINHD-1X3  [1X03]
JP5  PINHD-1X3  [1X03]
L1  2,2µH  L-EU  [ODD-INDUCTOR]
L3  2,2µH  L-EU  [ODD-INDUCTOR]
L4  2,2µH  L-EU  [ODD-INDUCTOR]
L5  2,2µH  L-EU  [ODD-INDUCTOR]
LED1  LEDCHIPLED_0805  [CHIPLED_0805]
LED2  LEDCHIPLED_0805  [CHIPLED_0805]
Q1  24Mhz  CRYSTALHC49U-V  [HC49U-V]
Q2  32kHz  CRYSTALTC38H  [TC38H]
Q3  IRLML2402  [SOT23]
R7  150k  R-EU_R0603  [R0603]
R11  47k  R-EU_R0603  [R0603]
R12  240 - 1%  R-EU_R0603  [R0603]
R13  2k - 1%  R-EU_R0603  [R0603]
R14  2k - 1%  R-EU_R0603  [R0603]
R16  1k  R-EU_R0603  [R0603]
R17  1k  R-EU_R0603  [R0603]
R46  10k  R-EU_R0603  [R0603]
R47  R-EU_R0603  [R0603]
R54  150k  R-EU_R0603  [R0603]
R55  200k  R-EU_R0603  [R0603]
R56  100k  R-EU_R0603  [R0603]
R57  680k  R-EU_R0603  [R0603]
R58  150k  R-EU_R0603  [R0603]
S-RST  SPARKFUN-SWITCHES_MOMENTARY-SWITCH-SPST-SMD-5.2-REDUNDANT  [SPARKFUN-SWITCHES_TACTILE_SWITCH_SMD_5.2MM]
U$4  EA3036  [QFN20]
U$6  XC6204  XC6204XC6204  [SOT25]
U$9  PT4101  [SOT23-6]

### Nets
5VNS: F1.1 J-PWR2.2 J-PWR.PWR
+1V2: C41.1 C44.2 C52.1 C53.1 C54.1 C55.1 C56.1 C62.1 C63.1 C64.1 C65.1 C66.1 C67.1 L3.P$1 R7.1 U$1.19(VDD-SYS3) U$1.20(VDD-CPU3) U$1.21(VDD-CPU2) U$1.25(VDD-CPU1) U$1.26(VDD-CPU0) U$1.38(VDD-CPU4) U$1.47(VDD-CPU5) U$1.51(VDD-CPU6) U$1.56(VDD-CPU7) U$1.58(VDD-SYS4) U$1.64(VDD-SYS5) U$1.80(VDD-SYS0) U$1.88(EPHY_VDD) U$1.108(VDD-SYS1) U$1.126(VDD-SYS2) ; also sheet 2
+1V8: C14.2 C38.2 C39.1 C42.1 C43.2 C47.1 C50.1 C51.1 L4.P$1 R13.2 R55.1 U$1.59(VCC-DRAM8) U$1.60(VCC-DRAM9) U$1.61(VCC-DRAM10) U$1.62(VCC-DRAM11) U$1.65(VCC-DRAM0) U$1.66(VCC-DRAM1) U$1.67(VCC-DRAM2) U$1.68(VCC-DRAM3) U$1.69(VCC-DRAM4) U$1.70(VCC-DRAM5) U$1.72(VCC-DRAM6) U$1.79(VCC-DRAM7) ; also sheet 2
+2V5: C76.1 JP3.1 U$6.5(VOUT)
+3V3: C31.1 C45.1 C46.2 C57.1 C58.1 C59.1 C60.1 C61.1 C69.1 C70.1 JP3.3 JP5.1 L5.P$1 R11.2 R57.1 U$1.50(VCC-3) U$1.57(VCC-2) U$1.85(VCC-MCSI) U$1.93(EPHY_VCC) U$1.104(VCC-0) U$1.109(VCC-USB) U$1.127(VCC-1) U$6.1(VIN) U$6.3(CE) ; also sheet 1,2,3,5
+3V3A: C37.1 C68.1 C71.1 C72.1 IC1.2(OUT) U$1.76(VCC-PLL) U$1.115(AVCC) ; also sheet 1,3
+3V3ANC: IC1.4(IN1)
+5V: C32.1 C33.1 C35.1 C36.1 C40.1 C73.1 IC1.3(IN) L1.P$1 Q3.3(DRAIN) R16.2 U$4.7(VIN2) U$4.8(EN2) U$4.9(EN1) U$4.10(VIN1) U$4.16(VCC) U$4.18(EN3) U$4.19(VIN3) U$9.6(IN) ; also sheet 1,2,3
GND: C7.2 C8.2 C10.2 C11.1 C12.1 C13.2 C15.1 C31.2 C32.2 C33.2 C35.2 C36.2 C37.2 C38.1 C39.2 C40.2 C43.1 C44.1 C46.1 C47.2 C50.2 C51.2 C52.2 C53.2 C54.2 C55.2 C56.2 C57.2 C58.2 C59.2 C60.2 C61.2 C62.2 C63.2 C64.2 C65.2 C66.2 C67.2 C68.2 C69.2 C70.2 C71.2 C72.2 C73.2 C74.2 C75.2 C76.2 IC1.1(GND) J-PWR2.1 J-PWR.GND J-PWR.GNDBREAK JP5.3 LED1.C LED2.C R12.2 R14.1 R46.2 R47.2 R54.1 R56.1 R58.1 S-RST.1 S-RST.2 U$1.116(AGND) U$1.P$1(PAD) U$4.1(GND3) U$4.4(GND2) U$4.5(GND2) U$4.12(GND1) U$4.13(GND1) U$4.15(AGND) U$4.17(AGND) U$4.21(PAD) U$6.2(VSS) U$9.2(GND) ; also sheet 1,2,3,5
N$3: LED1.A R16.1
N$6: LED2.A R17.1
N$9: R46.1 U$9.4(EN)
N$10: D1.A L1.P$2 U$9.1(SW)
N$23: C7.1 U$1.97(RTC-VIO)
N$26: JP5.2 U$1.98(VCC-RTC)
N$29: C10.1 Q2.2 U$1.95(X32KOUT)
N$30: C8.1 Q2.1 U$1.96(X32KIN)
N$32: C11.2 Q1.1 U$1.74(X24MOUNT)
N$33: C12.2 Q1.2 U$1.75(X24MIN)
N$35: C13.1 R11.1 S-RST.3 S-RST.4 U$1.99(RESET)
N$36: R12.1 U$1.73(SZQ)
N$58: L4.P$2 U$4.6(LX2)
N$59: L3.P$2 U$4.11(LX1)
N$60: C41.2 R7.2 R54.2 U$4.14(FB1)
N$69: C42.2 R55.2 R56.2 U$4.3(FB2)
N$70: L5.P$2 U$4.20(LX3)
N$71: C45.2 R57.2 R58.2 U$4.2(FB3)
PB2: R17.2 ; also sheet 1
SVREF: C14.1 C15.2 R13.1 R14.2 U$1.63(SVREF1) U$1.71(SVREF0)
V_PWR: F1.2 Q3.1(GATE) Q3.2(SOURCE)
VCC-PE: JP3.2 U$1.12(VCC-PE0) U$1.29(VCC-PE1) ; also sheet 1
VLED+: C74.1 C75.1 D1.C U$9.5(OV) ; also sheet 2
VLED-: R47.1 U$9.3(FB) ; also sheet 2

### Notes on the sheet
- Power CPU / SYS / USB / MIPI CSI / GPIO
- Power DRAM
- LEDs
- Copyright (c) 2018 Marcel Thürmer <marcel.thuermer@smail.emt.h-brs.de>
  Open Source Hardware under the 3-clause BSD License
- Reset / Clock
- VCC / RTC / PLL

## Sheet 5 of 5: sn65lvds84
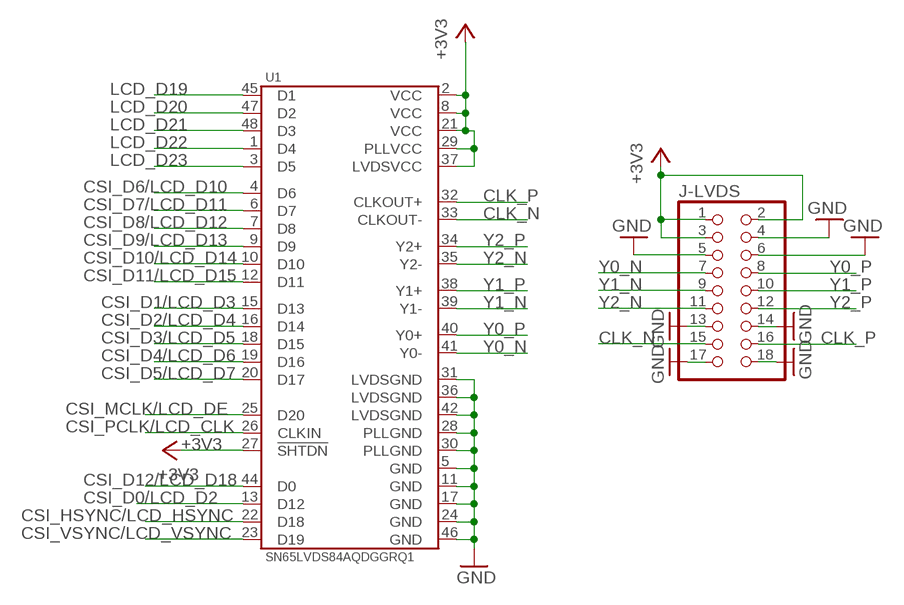
[diagram p4: schematic, sheet 5]

### Parts
J-LVDS  PINHEAD_PINHD-2X9M  [PINHEAD_2X09M]
U1  SN65LVDS84AQDGGRQ1  [TFSOP-48-6.1MM]

### Nets
+3V3: J-LVDS.1 J-LVDS.2 J-LVDS.3 U1.2(VCC) U1.8(VCC) U1.21(VCC) U1.27(!SHTDN) U1.29(PLLVCC) U1.37(LVDSVCC) ; also sheet 1,2,3,4
CLK_N: J-LVDS.15 U1.33(CLKOUT-)
CLK_P: J-LVDS.16 U1.32(CLKOUT+)
CSI_D0/LCD_D2: U1.13(D12) ; also sheet 1,2
CSI_D1/LCD_D3: U1.15(D13) ; also sheet 1,2
CSI_D2/LCD_D4: U1.16(D14) ; also sheet 1,2
CSI_D3/LCD_D5: U1.18(D15) ; also sheet 1,2
CSI_D4/LCD_D6: U1.19(D16) ; also sheet 1,2
CSI_D5/LCD_D7: U1.20(D17) ; also sheet 1,2
CSI_D6/LCD_D10: U1.4(D6) ; also sheet 1,2
CSI_D7/LCD_D11: U1.6(D7) ; also sheet 1,2
CSI_D8/LCD_D12: U1.7(D8) ; also sheet 1,2
CSI_D9/LCD_D13: U1.9(D9) ; also sheet 1,2
CSI_D10/LCD_D14: U1.10(D10) ; also sheet 1,2
CSI_D11/LCD_D15: U1.12(D11) ; also sheet 1,2
CSI_D12/LCD_D18: U1.44(D0) ; also sheet 1,2
CSI_HSYNC/LCD_HSYNC: U1.22(D18) ; also sheet 1,2
CSI_MCLK/LCD_DE: U1.25(D20) ; also sheet 1,2
CSI_PCLK/LCD_CLK: U1.26(CLKIN) ; also sheet 1,2
CSI_VSYNC/LCD_VSYNC: U1.23(D19) ; also sheet 1,2
GND: J-LVDS.4 J-LVDS.5 J-LVDS.6 J-LVDS.13 J-LVDS.14 J-LVDS.17 J-LVDS.18 U1.5(GND) U1.11(GND) U1.17(GND) U1.24(GND) U1.28(PLLGND) U1.30(PLLGND) U1.31(LVDSGND) U1.36(LVDSGND) U1.42(LVDSGND) U1.46(GND) ; also sheet 1,2,3,4
LCD_D19: U1.45(D1) ; also sheet 1,2
LCD_D20: U1.47(D2) ; also sheet 1,2
LCD_D21: U1.48(D3) ; also sheet 1,2
LCD_D22: U1.1(D4) ; also sheet 1,2
LCD_D23: U1.3(D5) ; also sheet 1,2
Y0_N: J-LVDS.7 U1.41(Y0-)
Y0_P: J-LVDS.8 U1.40(Y0+)
Y1_N: J-LVDS.9 U1.39(Y1-)
Y1_P: J-LVDS.10 U1.38(Y1+)
Y2_N: J-LVDS.11 U1.35(Y2-)
Y2_P: J-LVDS.12 U1.34(Y2+)

## Library data of the parts
ANT1 R1 R2 R7-R17 R19-R30 R32 R36 R38-R47 R52-R58 = rcl:R-EU_: RESISTOR, European symbol
C1-C31 C34 C36-C39 C41 C42 C45 C47-C76 = rcl:C-EU: CAPACITOR, European symbol
C32 C33 C35 C40 C43 C44 C46 = rcl@1:C-EU: CAPACITOR, European symbol; SPICEPREFIX: C
C77 = resistor:C-EU: CAPACITOR, European symbol
D1 = diode:DIODE-: DIODE
F1 = adafruit:PTCFUSE: PTC fuses, resettable thermistors
H1 H2 H4 = holes:MOUNT-HOLE: MOUNTING HOLE with drill center marker
H3 = holes@1:MOUNT-HOLE: MOUNTING HOLE with drill center marker
IC1 = v-reg-2:LM1117
J2 = SparkFun-Connectors:AUDIO_JACK_TRRS: Audio Jack - 3.5mm TRRS (SMD) This is a 3.5mm TRRS SMD audio jack. TRRS connectors are the audio-style connectors that you see on some phones, MP3 players and development boards. TRRS stands for “tip, ring, ring, sleeve,” which reflects that this has three conductors and a ground. SparkFun Products: Audio Jack <https://www.sparkfun.com/products/12639> mbed Starter Kit <https://www.sparkfun.com/products/12968> SparkFun TRRS 3.5mm Jack Breakout <https://www.sparkfun.com/products/11570>; PROD_ID: CONN-10676; SF_ID: PRT-12639
J3 = Connectors:USB
J4 = EAGLE-FPC_CONNECTOR_AND_FFC_CAB-rev16b:68611514122: WR-FPC 1.00mm SMT ZIF Horizontal Top Contact, 15 Pins=>Code : Con_FPC_ZIF_1.00_68611514122 <http://katalog.we-online.de/media/images/eican/Con_FPC_ZIF_1.00_6861xx14122_pf2.jpg> Details see: http://katalog.we-online.de/en/em/686_1xx_141_22 Created 2014-07-09, Karrer Zheng 2014 (C) Würth Elektronik
J-AUDIO = srg:JST-PH_4-PIN_HEADER: 4-pin JST PH Shrouded Header, top entry P/N B4B-PH-K-S Mating connector PHR-4 Mating cable assembly: Sparkfun PRT-09916 <http://www.sparkfun.com/products/9916>
J-CAM-FFC = con-molex:52745-2290: FFC/FPC-to-Board 0.50mm (.020") SMT Top Contact Right Angle, ZIF, Style Receptacle 52745 / 52435 Source: http://www.molex.com/product/ffc/52745.html; OC_FARNELL: unknown; OC_NEWARK: unknown
J-LCD-FFC = adafruit:40PINFPC: OMRON FPC Connector Source : http://www.omron.com/ecb/products/pdf/fpc.pdf XF2M-4015-rev is good for connecting up 'PSP' SHARP LQ043 LCDs
J-LVDS = Blueberry Pi:PINHEAD_PINHD-2X9: PIN HEADER
J-PWR = SparkFun-Connectors:POWER_JACK: Power Jack Connector This is the standard 5.5mm barrel jack for power. The PTH is the most common, proven, reliable, footprint. The Slot footprint only works if the mill layer is transmitted to the PCB fab house so be warned. Here are the connectors we sell at SparkFun: DC Barrel Power Jack/Connector <https://www.sparkfun.com/products/119> (PRT-00119) DC Barrel Power Jack/Connector (SMD) <https://www.sparkfun.com/products/12748> (PRT-12748) DC Barrel Jack Adapter - Breadboard Compatible <https://www.sparkfun.com/products/10811> (PRT-10811) It is used on this SparkFun product (and many, many others): SparkFun RedBoard - Programmed with Arduino <https://www.sparkfun.com/products/12757> (DEV-12757) Also, if you need a mating power supply or connector, please check these out: Wall Adapter Power Supply - 9VDC 650mA <https://www.sparkfun.com/products/298> (TOL-00298) DC Barrel Jack Adapter - Male <https://www.sparkfun.com/products/10287> (PRT-10287); PROD_ID: CONN-08197; SF_ID: PRT-00119
J-PWR2 = SparkFun-Connectors:CONN_02: Multi connection point. Often used as Generic Header-pin footprint for 0.1 inch spaced/style header connections On any of the 0.1 inch spaced packages, you can populate with these: Break Away Headers - Straight <https://www.sparkfun.com/products/116> (PRT-00116) Break Away Male Headers - Right Angle <https://www.sparkfun.com/products/553> (PRT-00553) Female Headers <https://www.sparkfun.com/products/115> (PRT-00115) Break Away Headers - Machine Pin <https://www.sparkfun.com/products/117> (PRT-00117) Break Away Female Headers - Swiss Machine Pin <https://www.sparkfun.com/products/743> (PRT-00743) For SCREWTERMINALS and SPRING TERMINALS visit here: Screw Terimnals on SparkFun.com <https://www.sparkfun.com/search/results?term=Screw+Terminals> (5mm/3.5mm/2.54mm spacing) This device is also useful as a general connection point to wire up your design to another part of your project. Our various solder wires solder well into these plated through hole pads. Hook-Up Wire - Assortment (Stranded, 22 AWG) <https://www.sparkfun.com/products/11375> (PRT-11375) Hook-Up Wire - Assortment (Solid Core, 22 AWG) <https://www.sparkfun.com/products/11367> (PRT-11367) View the entire wire category on our website here <https://www.sparkfun.com/categories/141> Special notes: Molex polarized connector foot print use with: PRT-08233 with associated crimp pins and housings. 2.54_SCREWTERM for use with PRT-10571. 3.5mm Screw Terminal footprints for PRT-08084 5mm Screw Terminal footprints for use with PRT-08432
J-VLED = con-molex:87758-0216: 2 Pin - 2mm Dual Row Single Wafer, Vertical T/H HDR Source: http://www.molex.com/pdm_docs/sd/877580616_sd.pdf; MPN: 87758-0216; OC_FARNELL: unknown; OC_NEWARK: 94M1513
JP1 = pinhead:PINHD-2X13: PIN HEADER
JP2 = pinhead-1:PINHD-1X6: PIN HEADER
JP3 JP5 JP7 = pinhead:PINHD-1X3: PIN HEADER
JP10 = pinhead:PINHD-2X10: PIN HEADER
JP11 JP12 = pinhead:PINHD-2X8: PIN HEADER
L1-L5 = rcl:L-EU: INDUCTOR, European symbol
LED1 LED2 = led:LED: LED OSRAM: - CHIPLED LG R971, LG N971, LY N971, LG Q971, LY Q971, LO R971, LY R971 LH N974, LH R974 LS Q976, LO Q976, LY Q976 LO Q996 - Hyper CHIPLED LW Q18S LB Q993, LB Q99A, LB R99A - SideLED LS A670, LO A670, LY A670, LG A670, LP A670 LB A673, LV A673, LT A673, LW A673 LH A674 LY A675 LS A676, LA A676, LO A676, LY A676, LW A676 LS A679, LY A679, LG A679 - Hyper Micro SIDELED® LS Y876, LA Y876, LO Y876, LY Y876 LT Y87S - SmartLED LW L88C, LW L88S LB L89C, LB L89S, LG L890 LS L89K, LO L89K, LY L89K LS L896, LA L896, LO L896, LY L896 - TOPLED LS T670, LO T670, LY T670, LG T670, LP T670 LSG T670, LSP T670, LSY T670, LOP T670, LYG T670 LG T671, LOG T671, LSG T671 LB T673, LV T673, LT T673, LW T673 LH T674 LS T676, LA T676, LO T676, LY T676, LB T676, LH T676, LSB T676, LW T676 LB T67C, LV T67C, LT T67C, LS T67K, LO T67K, LY T67K, LW E67C LS E67B, LA E67B, LO E67B, LY E67B, LB E67C, LV E67C, LT E67C LW T67C LS T679, LY T679, LG T679 LS T770, LO T770, LY T770, LG T770, LP T770 LB T773, LV T773, LT T773, LW T773 LH T774 LS E675, LA E675, LY E675, LS T675 LS T776, LA T776, LO T776, LY T776, LB T776 LHGB T686 LT T68C, LB T68C - Hyper Mini TOPLED® LB M676 - Mini TOPLED Santana® LG M470 LS M47K, LO M47K, LY M47K Source: http://www.osram.convergy.de LUXEON: - LUMILED® LXK2-PW12-R00, LXK2-PW12-S00, LXK2-PW14-U00, LXK2-PW14-V00 LXK2-PM12-R00, LXK2-PM12-S00, LXK2-PM14-U00 LXK2-PE12-Q00, LXK2-PE12-R00, LXK2-PE12-S00, LXK2-PE14-T00, LXK2-PE14-U00 LXK2-PB12-K00, LXK2-PB12-L00, LXK2-PB12-M00, LXK2-PB14-N00, LXK2-PB14-P00, LXK2-PB14-Q00 LXK2-PR12-L00, LXK2-PR12-M00, LXK2-PR14-Q00, LXK2-PR14-R00 LXK2-PD12-Q00, LXK2-PD12-R00, LXK2-PD12-S00 LXK2-PH12-R00, LXK2-PH12-S00 LXK2-PL12-P00, LXK2-PL12-Q00, LXK2-PL12-R00 Source: www.luxeon.com KINGBRIGHT: KA-3528ASYC Source: www.kingbright.com
MIC = microphon:ELECTRET_MICROPHON-: Electret Condenser Microphone
Q1 = crystal:CRYSTAL: CRYSTAL; OC_FARNELL: 1666969; OC_NEWARK: unknown
Q2 = crystal:CRYSTAL: CRYSTAL; OC_FARNELL: unknown; OC_NEWARK: unknown
Q3 Q4 = work:IRLML2402
RN1 RN2 = resistor-dil:4R-N: Array Chip Resistor Source: RS Component / Phycomp; OC_FARNELL: unknown; OC_NEWARK: unknown
S-RST S-SEL S-START S-VOL+ S-VOL- = Blueberry Pi:SPARKFUN-SWITCHES_MOMENTARY-SWITCH-SPST: Momentary Switch (Pushbutton) - SPST Normally-open (NO) SPST momentary switches (buttons, pushbuttons). Variants PTH-12MM - 12mm square, through-hole Momentary Pushbutton Switch - 12mm Square <https://www.sparkfun.com/products/9190> (COM-09190) PTH-6.0MM, PTH-6.0MM-KIT - 6.0mm square, through-hole Mini Pushbutton Switch <https://www.sparkfun.com/products/97> (COM-00097) KIT package intended for soldering kit's - only one side of pads' copper is exposed. PTH-RIGHT-ANGLE-KIT - Right-angle, through-hole Right Angle Tactile Button <https://www.sparkfun.com/products/10791> - Used on SparkFun BigTime Watch Kit <https://www.sparkfun.com/products/11734> SMD-12MM - 12mm square, surface-mount Tactile Button - SMD (12mm) <https://www.sparkfun.com/products/12993> (COM-12993) Used on SparkFun PicoBoard <https://www.sparkfun.com/products/11888> SMD-4.5MM - 4.5mm Square Trackball Switch Used on SparkFun Blackberry Trackballer Breakout <https://www.sparkfun.com/products/13169> SMD-4.6MMX2.8MM - 4.60mm x 2.80mm, surface mount Used on SparkFun SAMD21 Mini Breakout <https://www.sparkfun.com/products/13664> SMD-5.2MM, SMD-5.2-REDUNDANT - 5.2mm square, surface-mount Mini Pushbutton Switch - SMD <https://www.sparkfun.com/products/8720> (COM-08720) Used on Arduino Pro Mini <https://www.sparkfun.com/products/11114> REDUNDANT package connects both switch circuits together SMD-6.0X3.5MM - 6.0 x 3.5mm, surface mount Momentary Reset Switch SMD <https://www.sparkfun.com/products/8229> (COM-08229) SMD-6.2MM-TALL - 6.2mm square, surface mount Tactile Button - SMD (6mm) <https://www.sparkfun.com/products/12992> Used on SparkFun Digital Sandbox <https://www.sparkfun.com/products/12651> SMD-RIGHT-ANGLE - Right-angle, surface mount Used on SparkFun Block for Intel® Edison - Arduino <https://www.sparkfun.com/products/13036>; PROD_ID: SWCH-08247; SF_SKU: COM-08720
U1 = TI:SN65LVDS84
U2 = SparkFun-IC-Memory:W25Q32FV: W25Q32FV 32Mb (4MB) Serial Flash Memory The W25Q32FV support the standard Serial Peripheral Interface (SPI), Dual/Quad I/O SPI as well as 2-clocks instruction cycle Quad Peripheral Interface (QPI). 104MHz, SPI, 8-SOIC-EIAJ Datasheet <http://www.winbond.com/resource-files/w25q32fv%20revh%20091613.pdf> SparkFun Products SparkFun Blynk Board - ESP8266 <https://www.sparkfun.com/products/13794> (WRL-13794); PROD_ID: IC-13229
U$1 = Allwinner V3s:V3S
U$2 = RTL8723BS_Modul:RTL8723BS
U$3 = HR911105A:HR911105A
U$4 = EA3036:EA3036
U$5 = con-hirose:MICRO-USB-SHIELD-: Hirose Micro USB Connector ZX62R-B-5P: Micro B, reverse (top mount) shell SMT Supplier: DigiKey H11574CT-ND Source: http://www.hirose.co.jp/cataloge_hp/e24200011.pdf
U$6 = XC6204:XC6204
U$7 = tsc2003:TSC2003
U$8 = NS2009:NS2009
U$9 = PT4101:PT4101
U$11 = microsd:MICROSD-PUSH-OUT: T-Flash Push-Out Micro SD Card Reader 14.75mm x 14.5mm SMD with external pins
X2 = con-molex:87758-1216: 12 Pin - 2mm Dual Row Single Wafer, Vertical T/H HDR Source: http://www.molex.com/pdm_docs/sd/877580616_sd.pdf; MPN: 87758-1216; OC_FARNELL: unknown; OC_NEWARK: 25M5671

## Net classes
0 default: clearance 0.355 mm

## Board
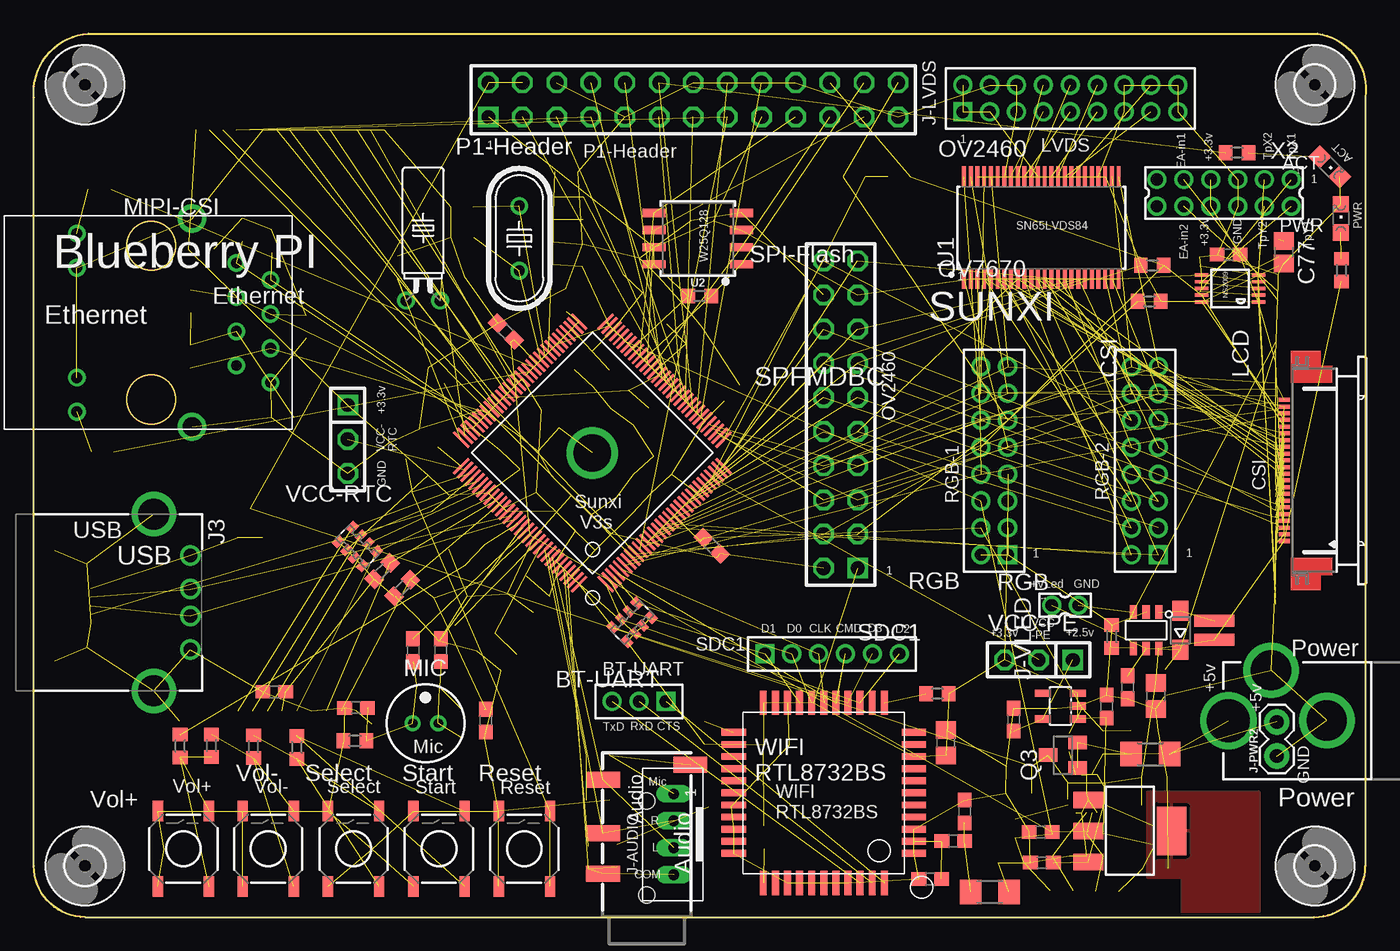
[diagram p5: board, top side]
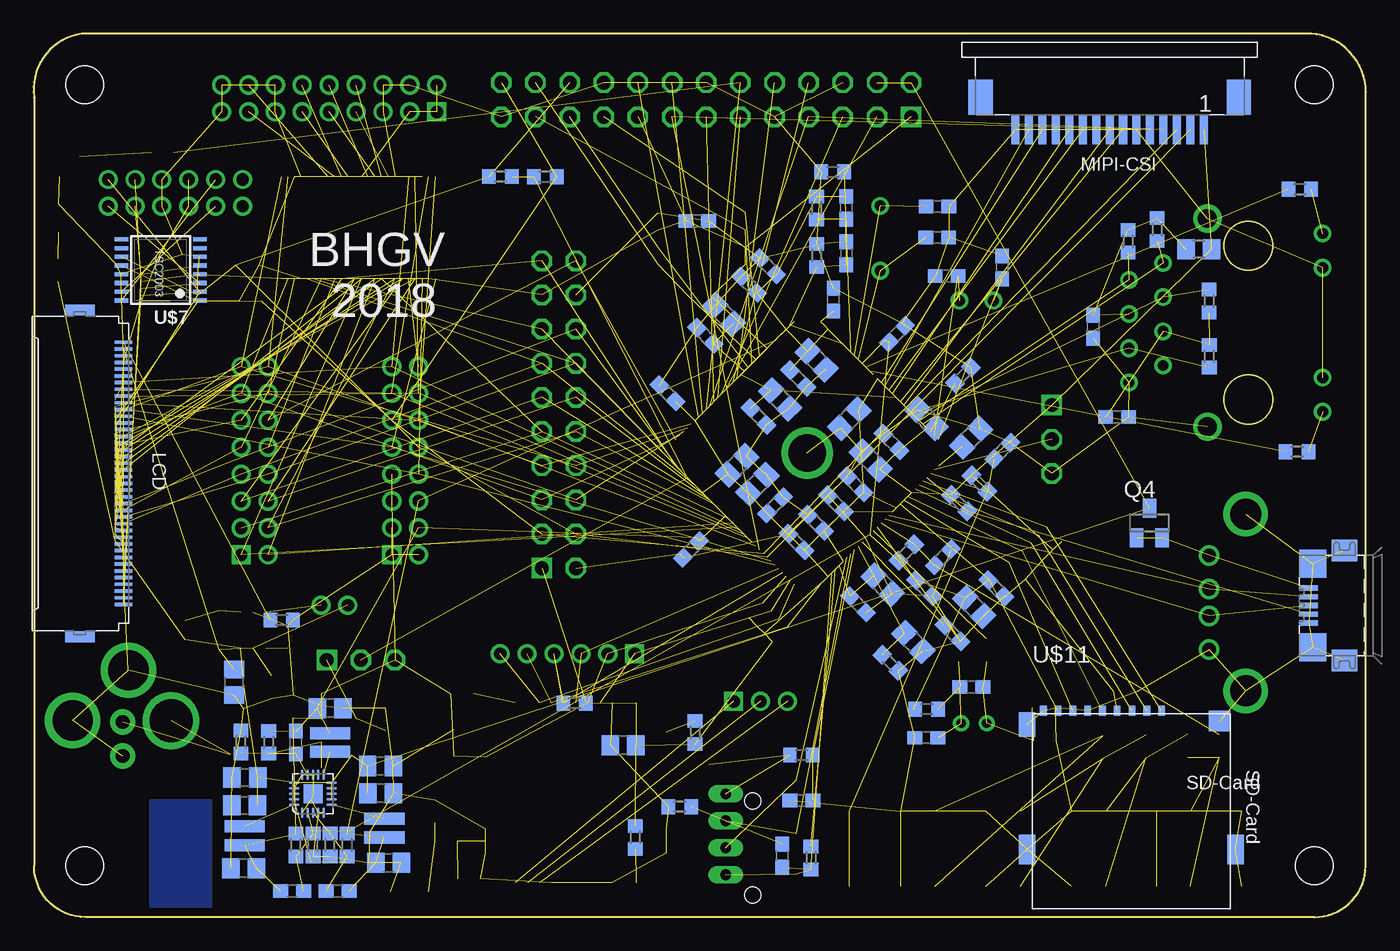
[diagram p6: board, bottom side, seen from below]

Size 99.11 x 65.7 mm. Coordinates in mm from the lower left corner, seen from the top.
Outline: 3.82,0 95.26,0 arc90 99.07,3.81 99.07,60.96 arc90 95.51,65.7 4.07,65.7 arc90 0.01,60.96 0.01,3.81 arc90 3.82,0
Copper layers (1*16): Top 0.035mm / dielectric 1.5mm / Bottom 0.035mm
Design rules "SeeedStudio_2layer_DRU_no_angle_20140221": minimum track width 6mil, minimum drill 12mil, track to track 6mil, track to pad 6mil, pad to pad 6mil, via to via 6mil, smd to smd 0mil, copper to edge 10mil, drill to drill 10mil, minimum pad ring 10mil, minimum via ring 6mil, stop-mask expansion 2mil, vias tented up to drill 100mil, thermal gap 10mil

### Footprints (pad centres in the part's own frame; a part is rotated, then mirrored left to right if it is on the bottom)
R1206 = smd 1.6 x 1.803: 1 -1.422,0; 2 1.422,0
C0603 = smd 1.1 x 1: 1 -0.85,0; 2 0.85,0
C0805 = smd 1.3 x 1.5: 1 -0.95,0; 2 0.95,0
C0805' = smd 1.3 x 1.5: 1 -0.85,0; 2 0.85,0
SOD323-W = smd 1.5 x 1.2: A 1.45,0; C -1.45,0
2,8 = hole 2.8: 0,0
SOT223 = smd 1.219 x 2.235: 1 -2.311,-3.099; 2 0,-3.099; 3 2.311,-3.099 | smd 3.6 x 2.2: 4 0,3.099
AUDIO_JACK_3.5MM_TRRS_SMD_RA = smd 1.2 x 2.5: EARTH 11.3,-3.25; RING1 6.2,3.25; RING2 3.2,3.25; TIP 10.2,3.25 | hole 1.2: 1.6,0; 8.6,0
USB-A-FEMALE = drill 1: 1 -3.5,2.71; 2 -1,2.71; 3 1,2.71; 4 3.5,2.71 | drill 2.3: P$1 6.57,0; P$2 -6.57,0
68611514122 = smd 0.6 x 2.2: 1 -7,2.4; 2 -6,2.4; 3 -5,2.4; 4 -4,2.4; 5 -3,2.4; 6 -2,2.4; 7 -1,2.4; 8 0,2.4; 9 1,2.4; 10 2,2.4; 11 3,2.4; 12 4,2.4; 13 5,2.4; 14 6,2.4; 15 7,2.4 | smd 1.8 x 2.6: Z1 -9.6,0; Z2 9.6,0
JST_B4B-PH_HEADER = drill 0.8 long: P1 2.98,0.048; P2 0.98,0.048; P3 -1.02,0.048; P4 -3.02,0.048
52745-2290 = smd 0.3 x 0.8: 1 -5.25,2.5; 2 -4.75,2.5; 3 -4.25,2.5; 4 -3.75,2.5; 5 -3.25,2.5; 6 -2.75,2.5; 7 -2.25,2.5; 8 -1.75,2.5; 9 -1.25,2.5; 10 -0.75,2.5; 11 -0.25,2.5; 12 0.25,2.5; 13 0.75,2.5; 14 1.25,2.5; 15 1.75,2.5; 16 2.25,2.5; 17 2.75,2.5; 18 3.25,2.5; 19 3.75,2.5; 20 4.25,2.5; 21 4.75,2.5; 22 5.25,2.5
XF2H-4015-1LW = smd 1.3 x 0.25: 1 3.175,9.75; 2 3.175,9.25; 3 3.175,8.75; 4 3.175,8.25; 5 3.175,7.75; 6 3.175,7.25; 7 3.175,6.75; 8 3.175,6.25; 9 3.175,5.75; 10 3.175,5.25; 11 3.175,4.75; 12 3.175,4.25; 13 3.175,3.75; 14 3.175,3.25; 15 3.175,2.75; 16 3.175,2.25; 17 3.175,1.75; 18 3.175,1.25; 19 3.175,0.75; 20 3.175,0.25; 21 3.175,-0.25; 22 3.175,-0.75; 23 3.175,-1.25; 24 3.175,-1.75; 25 3.175,-2.25; 26 3.175,-2.75; 27 3.175,-3.25; 28 3.175,-3.75; 29 3.175,-4.25; 30 3.175,-4.75; 31 3.175,-5.25; 32 3.175,-5.75; 33 3.175,-6.25; 34 3.175,-6.75; 35 3.175,-7.25; 36 3.175,-7.75; 37 3.175,-8.25; 38 3.175,-8.75; 39 3.175,-9.25; 40 3.175,-9.75 | smd 2.2 x 0.8: M1 -0.075,12.15; M2 -0.075,-12.15
PINHEAD_2X09M = drill 0.914 square: 1 -8,-1 | drill 0.914: 2 -8,1; 3 -6,-1; 4 -6,1; 5 -4,-1; 6 -4,1; 7 -2,-1; 8 -2,1; 9 0,-1; 10 0,1; 11 2,-1; 12 2,1; 13 4,-1; 14 4,1; 15 6,-1; 16 6,1; 17 8,-1; 18 8,1
POWER_JACK_PTH_LOCK = drill 2.997 pad 4.115: GND 0.025,6.557; GNDBREAK 3.762,10.7 | drill 3.2 pad 4.115: PWR 0,13.878
1X02 = drill 1.016 pad 1.88: 1 0,0; 2 2.54,0
87758-0216 = drill 0.9 pad 1.27: 1 0,-1; 2 0,1
2X13 = drill 1.016 square: 1 -15.24,-1.27 | drill 1.016 octagon: 2 -15.24,1.27; 3 -12.7,-1.27; 4 -12.7,1.27; 5 -10.16,-1.27; 6 -10.16,1.27; 7 -7.62,-1.27; 8 -7.62,1.27; 9 -5.08,-1.27; 10 -5.08,1.27; 11 -2.54,-1.27; 12 -2.54,1.27; 13 0,-1.27; 14 0,1.27; 15 2.54,-1.27; 16 2.54,1.27; 17 5.08,-1.27; 18 5.08,1.27; 19 7.62,-1.27; 20 7.62,1.27; 21 10.16,-1.27; 22 10.16,1.27; 23 12.7,-1.27; 24 12.7,1.27; 25 15.24,-1.27; 26 15.24,1.27
1X06M = drill 0.914 square: 1 -5,0 | drill 0.914: 2 -3,0; 3 -1,0; 4 1,0; 5 3,0; 6 5,0
1X03 = drill 1.016 square: 1 -2.54,0 | drill 1.016 octagon: 2 0,0; 3 2.54,0
1X03M = drill 0.914 square: 1 -2,0 | drill 0.914: 2 0,0; 3 2,0
2X10 = drill 1.016 square: 1 -11.43,-1.27 | drill 1.016 octagon: 2 -11.43,1.27; 3 -8.89,-1.27; 4 -8.89,1.27; 5 -6.35,-1.27; 6 -6.35,1.27; 7 -3.81,-1.27; 8 -3.81,1.27; 9 -1.27,-1.27; 10 -1.27,1.27; 11 1.27,-1.27; 12 1.27,1.27; 13 3.81,-1.27; 14 3.81,1.27; 15 6.35,-1.27; 16 6.35,1.27; 17 8.89,-1.27; 18 8.89,1.27; 19 11.43,-1.27; 20 11.43,1.27
2X08M = drill 0.914 square: 1 -7,-1 | drill 0.914: 2 -7,1; 3 -5,-1; 4 -5,1; 5 -3,-1; 6 -3,1; 7 -1,-1; 8 -1,1; 9 1,-1; 10 1,1; 11 3,-1; 12 3,1; 13 5,-1; 14 5,1; 15 7,-1; 16 7,1
ODD-INDUCTOR = smd 0.9 x 3: P$1 -0.7,0; P$2 0.7,0
L0805 = smd 1.3 x 1.5: 1 -0.95,0; 2 0.95,0
CHIPLED_0805 = smd 1.2 x 1.2: A 0,-1.05; C 0,1.05
F6035AP = drill 0.7 pad 1.2: 1 0,0.95; 2 0,-0.95
HC49U-V = drill 0.813: 1 -2.413,0; 2 2.413,0
TC38H = drill 0.813: 1 -1.27,0; 2 1.27,0
SOT23 = smd 1 x 1.4: 1 -0.95,-1.1; 2 0.95,-1.1; 3 0,1.1
R0603 = smd 1 x 1.1: 1 -0.85,0; 2 0.85,0
EXB38V = smd 0.6 x 0.8: 1 -1.275,-0.75; 4 1.275,-0.75; 5 1.275,0.75; 8 -1.275,0.75 | smd 0.5 x 0.8: 2 -0.4,-0.75; 3 0.4,-0.75; 6 0.4,0.75; 7 -0.4,0.75
SPARKFUN-SWITCHES_TACTILE_SWITCH_SMD_5.2MM = smd 1.524 x 0.762: 1 -2.794,1.905; 2 2.794,1.905; 3 -2.794,-1.905; 4 2.794,-1.905
TFSOP-48-6.1MM = smd 1.5 x 0.29: 1 -3.8,5.75; 2 -3.8,5.25; 3 -3.8,4.75; 4 -3.8,4.25; 5 -3.8,3.75; 6 -3.8,3.25; 7 -3.8,2.75; 8 -3.8,2.25; 9 -3.8,1.75; 10 -3.8,1.25; 11 -3.8,0.75; 12 -3.8,0.25; 13 -3.8,-0.25; 14 -3.8,-0.75; 15 -3.8,-1.25; 16 -3.8,-1.75; 17 -3.8,-2.25; 18 -3.8,-2.75; 19 -3.8,-3.25; 20 -3.8,-3.75; 21 -3.8,-4.25; 22 -3.8,-4.75; 23 -3.8,-5.25; 24 -3.8,-5.75; 25 3.8,-5.75; 26 3.8,-5.25; 27 3.8,-4.75; 28 3.8,-4.25; 29 3.8,-3.75; 30 3.8,-3.25; 31 3.8,-2.75; 32 3.8,-2.25; 33 3.8,-1.75; 34 3.8,-1.25; 35 3.8,-0.75; 36 3.8,-0.25; 37 3.8,0.25; 38 3.8,0.75; 39 3.8,1.25; 40 3.8,1.75; 41 3.8,2.25; 42 3.8,2.75; 43 3.8,3.25; 44 3.8,3.75; 45 3.8,4.25; 46 3.8,4.75; 47 3.8,5.25; 48 3.8,5.75
SOIC-8 = smd 0.61 x 1.702: 1 -1.905,-3.251; 2 -0.635,-3.251; 3 0.635,-3.251; 4 1.905,-3.251; 5 1.905,3.251; 6 0.635,3.251; 7 -0.635,3.251; 8 -1.905,3.251
QFP-128 = smd 0.2 x 1.6: 1 -6.2,-7.6; 2 -5.8,-7.6; 3 -5.4,-7.6; 4 -5,-7.6; 5 -4.6,-7.6; 6 -4.2,-7.6; 7 -3.8,-7.6; 8 -3.4,-7.6; 9 -3,-7.6; 10 -2.6,-7.6; 11 -2.2,-7.6; 12 -1.8,-7.6; 13 -1.4,-7.6; 14 -1,-7.6; 15 -0.6,-7.6; 16 -0.2,-7.6; 17 0.2,-7.6; 18 0.6,-7.6; 19 1,-7.6; 20 1.4,-7.6; 21 1.8,-7.6; 22 2.2,-7.6; 23 2.6,-7.6; 24 3,-7.6; 25 3.4,-7.6; 26 3.8,-7.6; 27 4.2,-7.6; 28 4.6,-7.6; 29 5,-7.6; 30 5.4,-7.6; 31 5.8,-7.6; 32 6.2,-7.6; 65 6.2,7.6; 66 5.8,7.6; 67 5.4,7.6; 68 5,7.6; 69 4.6,7.6; 70 4.2,7.6; 71 3.8,7.6; 72 3.4,7.6; 73 3,7.6; 74 2.6,7.6; 75 2.2,7.6; 76 1.8,7.6; 77 1.4,7.6; 78 1,7.6; 79 0.6,7.6; 80 0.2,7.6; 81 -0.2,7.6; 82 -0.6,7.6; 83 -1,7.6; 84 -1.4,7.6; 85 -1.8,7.6; 86 -2.2,7.6; 87 -2.6,7.6; 88 -3,7.6; 89 -3.4,7.6; 90 -3.8,7.6; 91 -4.2,7.6; 92 -4.6,7.6; 93 -5,7.6; 94 -5.4,7.6; 95 -5.8,7.6; 96 -6.2,7.6 | smd 1.6 x 0.2: 33 7.6,-6.2; 34 7.6,-5.8; 35 7.6,-5.4; 36 7.6,-5; 37 7.6,-4.6; 38 7.6,-4.2; 39 7.6,-3.8; 40 7.6,-3.4; 41 7.6,-3; 42 7.6,-2.6; 43 7.6,-2.2; 44 7.6,-1.8; 45 7.6,-1.4; 46 7.6,-1; 47 7.6,-0.6; 48 7.6,-0.2; 49 7.6,0.2; 50 7.6,0.6; 51 7.6,1; 52 7.6,1.4; 53 7.6,1.8; 54 7.6,2.2; 55 7.6,2.6; 56 7.6,3; 57 7.6,3.4; 58 7.6,3.8; 59 7.6,4.2; 60 7.6,4.6; 61 7.6,5; 62 7.6,5.4; 63 7.6,5.8; 64 7.6,6.2; 97 -7.6,6.2; 98 -7.6,5.8; 99 -7.6,5.4; 100 -7.6,5; 101 -7.6,4.6; 102 -7.6,4.2; 103 -7.6,3.8; 104 -7.6,3.4; 105 -7.6,3; 106 -7.6,2.6; 107 -7.6,2.2; 108 -7.6,1.8; 109 -7.6,1.4; 110 -7.6,1; 111 -7.6,0.6; 112 -7.6,0.2; 113 -7.6,-0.2; 114 -7.6,-0.6; 115 -7.6,-1; 116 -7.6,-1.4; 117 -7.6,-1.8; 118 -7.6,-2.2; 119 -7.6,-2.6; 120 -7.6,-3; 121 -7.6,-3.4; 122 -7.6,-3.8; 123 -7.6,-4.2; 124 -7.6,-4.6; 125 -7.6,-5; 126 -7.6,-5.4; 127 -7.6,-5.8; 128 -7.6,-6.2 | drill 2.8: P$1 0,0
LGA = smd 1.8 x 0.51: P$1 -0.7,10.5; P$2 -0.7,9.6; P$3 -0.7,8.7; P$4 -0.7,7.8; P$5 -0.7,6.9; P$6 -0.7,6; P$7 -0.7,5.1; P$8 -0.7,4.2; P$9 -0.7,3.3; P$10 -0.7,2.4; P$11 -0.7,1.5; P$23 12.7,1.5; P$24 12.7,2.4; P$25 12.7,3.3; P$26 12.7,4.2; P$27 12.7,5.1; P$28 12.7,6; P$29 12.7,6.9; P$30 12.7,7.8; P$31 12.7,8.7; P$32 12.7,9.6; P$33 12.7,10.5 | smd 0.51 x 1.8: P$12 1.5,-0.7; P$13 2.4,-0.7; P$14 3.3,-0.7; P$15 4.2,-0.7; P$16 5.1,-0.7; P$17 6,-0.7; P$18 6.9,-0.7; P$19 7.8,-0.7; P$20 8.7,-0.7; P$21 9.6,-0.7; P$22 10.5,-0.7; P$34 10.5,12.7; P$35 9.6,12.7; P$36 8.7,12.7; P$37 7.8,12.7; P$38 6.9,12.7; P$39 6,12.7; P$40 5.1,12.7; P$41 4.2,12.7; P$42 3.3,12.7; P$43 2.4,12.7; P$44 1.5,12.7
RJ45 = drill 0.8: 1 -6.03,-4.12; 2 -8.57,-2.86; 3 -6.03,-1.58; 4 -8.57,-0.32; 5 -6.03,0.96; 6 -8.57,2.22; 7 -6.03,3.5; 8 -8.57,4.76; 9 5.84,-6.305; 10 5.84,-3.765; 11 5.84,4.405; 12 5.84,6.945 | drill 1.4: SHIELD1 -2.73,-7.425; SHIELD2 -2.73,8.065
QFN20 = smd 0.8 x 0.2: 1 -1.4,0.8; 2 -1.4,0.4; 3 -1.4,0; 4 -1.4,-0.4; 5 -1.4,-0.8; 11 1.4,-0.8; 12 1.4,-0.4; 13 1.4,0; 14 1.4,0.4; 15 1.4,0.8 | smd 0.2 x 0.8: 6 -0.8,-1.4; 7 -0.4,-1.4; 8 0,-1.4; 9 0.4,-1.4; 10 0.8,-1.4; 16 0.8,1.4; 17 0.4,1.4; 18 0,1.4; 19 -0.4,1.4; 20 -0.8,1.4 | smd 1.4 x 1.4: 21 0,0
ZX62R-B-5P = smd 1.35 x 0.4: 1 2.675,-1.3; 2 2.675,-0.65; 3 2.675,0; 4 2.675,0.65; 5 2.675,1.3 | smd 1.9 x 1.6: M1 0,-4.1; M2 0,4.1 | smd 2 x 2.1: M3 2.35,3.1; M4 2.35,-3.1
SOT25 = smd 0.55 x 1.2: 1 -0.95,-1.3; 2 0,-1.3; 3 0.95,-1.3; 4 0.95,1.3; 5 -0.95,1.3
TSSOP16 = smd 0.305 x 0.991: 1 -2.275,-2.918; 2 -1.625,-2.918; 3 -0.975,-2.918; 4 -0.325,-2.918; 5 0.325,-2.918; 6 0.975,-2.918; 7 1.625,-2.918; 8 2.275,-2.918; 9 2.275,2.918; 10 1.625,2.918; 11 0.975,2.918; 12 0.325,2.918; 13 -0.325,2.918; 14 -0.975,2.918; 15 -1.625,2.918; 16 -2.275,2.918
MSOP10 = smd 0.25 x 1: 1 -1,-2.113; 2 -0.5,-2.113; 3 0,-2.113; 4 0.5,-2.113; 5 1,-2.113; 6 1,2.113; 7 0.5,2.113; 8 0,2.113; 9 -0.5,2.113; 10 -1,2.113
SOT23-6 = smd 1 x 0.55: 1 -1.35,0.95; 2 -1.35,0; 3 -1.35,-0.95; 4 1.35,-0.95; 5 1.35,0; 6 1.35,0.95
MICROSD-PUSH-OUT = smd 0.5 x 0.75: 1 9.625,0.225; 2 8.525,0.225; 3 7.425,0.225; 4 6.325,0.225; 5 5.225,0.225; 6 4.125,0.225; 7 3.025,0.225; 8 1.925,0.225; CD 0.825,0.225 | smd 1.2 x 1.8: G1 -0.375,-0.8 | smd 1.2 x 2.2: G2 -0.375,-10.1; G4 15.125,-10.1 | smd 1.6 x 1.5: G3 13.95,-0.55
87758-1216 = drill 0.9 pad 1.27: 1 -5,-1; 2 -5,1; 3 -3,-1; 4 -3,1; 5 -1,-1; 6 -1,1; 7 1,-1; 8 1,1; 9 3,-1; 10 3,1; 11 5,-1; 12 5,1

### Placement (x,y rotation side)
ANT1  71.14,1.88 180 top
C1  49.74,51.77 0 bottom
C2  88.89,49.26 180 top
C3  67.86,12.97 90 top
C4  68.41,5.65 0 top
C5  66.7,2.85 180 top
C6  69.26,7.85 90 top
C7  29.38,35.66 45 bottom
C8  27.07,48.31 90 bottom
C9  17.91,16.76 180 top
C10  31.19,47.67 180 bottom
C11  31.86,52.83 180 bottom
C12  31.89,50.54 180 bottom
C13  27.05,34.68 45 bottom
C14  38.67,52.74 90 bottom
C15  38.65,49.37 270 bottom
C16  29.13,23.06 135 bottom
C17  41.99,8.68 180 bottom
C18  43.41,4.56 270 bottom
C19  27.49,24.46 135 bottom
C20  33.66,20.45 135 bottom
C21  30.75,21.11 135 bottom
C22  37.77,23.25 315 bottom
C23  32.7,13.34 0 bottom
C24  23.98,15.56 0 top
C25  29.34,17.11 180 bottom
C26  33.64,14.62 90 top
C27  30.3,19.85 270 top
C28  28.23,19.84 270 top
C29  35.95,24.71 135 bottom
C30  55.25,12.78 180 bottom
C31  79.82,15.66 90 top
C32  73.3,9.21 0 bottom
C33  83.39,10.39 180 bottom
C34  31.48,26.76 225 bottom
C35  73.31,11.23 0 bottom
C36  75.01,4.05 180 top
C37  74.91,6.34 180 top
C38  45.89,47.04 315 bottom
C39  42.23,40.05 315 bottom
C40  83.41,8.31 180 bottom
C41  79.6,12.98 270 bottom
C42  76.5,1.95 180 bottom
C43  72.71,4.04 180 bottom
C44  77.06,15.52 180 bottom
C45  79.88,1.93 0 bottom
C46  83.47,3.63 0 bottom
C47  44.47,48.41 135 bottom
C48  18.51,37.19 0 bottom
C49  20.29,43.9 270 bottom
C50  40.86,41.4 315 bottom
C51  39.61,45.92 90 bottom
C52  47.75,44.81 135 bottom
C53  49.14,43.23 135 bottom
C54  45.27,32.21 45 bottom
C55  50.45,27.61 315 top
C56  42.37,27.9 135 bottom
C57  40.9,29.34 135 bottom
C58  35.29,35.33 135 bottom
C59  36.84,33.96 135 bottom
C60  39.43,30.77 135 bottom
C61  43.58,38.5 315 bottom
C62  37.98,32.19 135 bottom
C63  46.78,33.6 45 bottom
C64  51.96,38.96 135 bottom
C65  43.96,30.63 45 bottom
C66  38.42,37.07 225 bottom
C67  50.2,27.33 225 bottom
C68  32.86,24.45 315 bottom
C69  32.68,37.06 135 bottom
C70  45.19,37.23 315 bottom
C71  34.87,43.36 45 bottom
C72  35.12,43.55 135 top
C73  83.48,16.44 270 top
C74  84.19,17.46 270 bottom
C75  81.39,17.09 270 top
C76  72.91,14.69 90 top
C77  [C0805']  93.01,49.44 270 top
D1  85.3,21.33 90 top
F1  83.07,12.12 180 top
H1  95.31,3.81 0 top
H2  3.82,3.81 0 top
H3  3.82,61.9 0 top
H4  95.31,61.9 0 top
IC1  81.56,6.41 270 top
J2  45.61,0.03 90 top
J3  8.95,23.39 270 top
J4  19.06,60.96 180 bottom
J-AUDIO  47.67,6.18 90 top
J-CAM-FFC  95.54,33.22 90 top
J-LCD-FFC  95.59,33 0 bottom
J-LVDS  77.12,60.88 0 top
J-PWR  102.76,14.6 90 top
J-PWR2  92.48,11.97 90 top
J-VLED  76.73,23.2 270 top
JP1  49.07,60.78 0 top
JP2  59.4,19.58 0 top
JP3  74.77,19.13 180 top
JP5  23.36,35.53 270 top
JP7  45.04,16.04 180 top
JP10  60.03,37.38 90 top
JP11  82.67,33.94 90 top
JP12  71.46,33.94 90 top
L1  87.84,21.33 90 top
L2  12.43,49.66 180 bottom
L3  77.06,12.98 270 bottom
L4  73.02,6.62 90 bottom
L5  83.41,6.05 90 bottom
LED1  97.25,51.96 0 top
LED2  96.42,55.8 225 top
MIC  29.15,14.41 90 top
Q1  36.13,50.47 270 top
Q2  28.98,45.85 0 top
Q3  76.57,12.04 90 top
Q4  16.1,29.3 0 bottom
R1  25.93,25.74 225 top
R2  27.42,24.48 225 top
R7  81.62,13 270 bottom
R8  49.55,46.18 0 top
R9  67.24,16.61 180 top
R10  54.34,5.93 90 bottom
R11  28.75,32.24 135 bottom
R12  39.66,55.42 180 bottom
R13  40.86,52.73 90 bottom
R14  40.85,49.2 270 bottom
R15  51.04,8.22 0 bottom
R16  97.3,48.11 270 top
R17  89.52,56.85 180 top
R19  49.9,13.72 270 bottom
R20  10.9,12.72 90 top
R21  13.23,12.75 270 top
R22  16.36,12.67 270 top
R23  19.58,12.62 270 top
R24  29.97,40.29 45 bottom
R25  41.99,12.05 0 bottom
R26  41.27,4.4 270 bottom
R27  35.38,18.91 135 bottom
R28  23.9,13.12 180 top
R29  34.18,27.11 225 bottom
R30  32.67,15.46 180 bottom
R32  30.25,30.79 315 bottom
R36  58.87,15.91 180 bottom
R38  82.99,45.79 180 top
R39  83.22,48.47 0 top
R40  11.67,45.81 270 bottom
R41  11.65,41.71 90 bottom
R42  15.53,51.12 90 bottom
R43  17.69,50.26 90 bottom
R44  61.05,55.05 0 bottom
R45  64.4,55.07 180 bottom
R46  80.2,20.87 90 top
R47  80.66,22.1 0 bottom
R52  5.12,34.61 0 bottom
R53  4.92,54.12 0 bottom
R54  83.68,13.02 270 bottom
R55  75.79,5.36 270 bottom
R56  77.06,5.36 90 bottom
R57  79.6,5.36 270 bottom
R58  78.33,5.36 90 bottom
RN1  44.51,21.92 45 top
RN2  24.09,27.56 315 top
S-RST  36.51,5.08 90 top
S-SEL  23.81,5.08 90 top
S-START  30.16,5.08 90 top
S-VOL+  11.15,5.08 90 top
S-VOL-  17.46,5.08 90 top
U1  74.96,51.27 90 top
U2  49.41,50.46 90 top
U$1  41.57,34.52 45 top
U$2  64.78,15.24 180 top
U$3  9.05,44.52 180 top
U$4  78.33,9.17 90 bottom
U$5  1.59,23.17 180 bottom
U$6  76.39,15.7 90 top
U$7  89.66,48.13 90 bottom
U$8  89,46.75 90 top
U$9  82.76,21.33 270 top
U$11  24.83,15.13 0 bottom
X2  88.57,53.85 180 top

### Tracks (layer width: path | path; a pad name or v marks a point on that pad's centre or on a via)
5VNS  (2 unrouted)
+1V2  (30 unrouted)
+1V8  (23 unrouted)
+2V5  (2 unrouted)
+3V3  (77 unrouted)
+3V3A  (11 unrouted)
+3V3ANC
  pour Bottom: 85.95,8.67 85.95,0.79 90.39,0.79 90.39,8.67
  pour Top: 83.66,8.54 90.39,8.54 90.39,0.28 85.95,0.28 85.95,4.09 83.66,4.09
+5V  (21 unrouted)
CLK_N  (1 unrouted)
CLK_P  (1 unrouted)
CSI_D0/LCD_D2  (5 unrouted)
CSI_D1/LCD_D3  (5 unrouted)
CSI_D2/LCD_D4  (5 unrouted)
CSI_D3/LCD_D5  (5 unrouted)
CSI_D4/LCD_D6  (5 unrouted)
CSI_D5/LCD_D7  (5 unrouted)
CSI_D6/LCD_D10  (5 unrouted)
CSI_D7/LCD_D11  (5 unrouted)
CSI_D8/LCD_D12  (5 unrouted)
CSI_D9/LCD_D13  (5 unrouted)
CSI_D10/LCD_D14  (4 unrouted)
CSI_D11/LCD_D15  (4 unrouted)
CSI_D12/LCD_D18  (4 unrouted)
CSI_HSYNC/LCD_HSYNC  (5 unrouted)
CSI_MCLK/LCD_DE  (5 unrouted)
CSI_PCLK/LCD_CLK  (5 unrouted)
CSI_VSYNC/LCD_VSYNC  (5 unrouted)
EA-IN1  (1 unrouted)
EA-IN2  (1 unrouted)
EPHY_RXN  (2 unrouted)
EPHY_RXP  (2 unrouted)
EPHY_TXN  (2 unrouted)
EPHY_TXP  (2 unrouted)
GND  (184 unrouted)
  pour Top: 85.44,0.28 85.44,2.95 82.9,2.95 82.9,9.3 91.15,9.3 91.15,0.28
HP_COM  (4 unrouted)
HP_COMFB  (1 unrouted)
HP_L  (2 unrouted)
HP_R  (2 unrouted)
I2C0/SCL  (1 unrouted)
I2C0/SDA  (1 unrouted)
I2C1/SCL  (9 unrouted)
I2C1/SDA  (9 unrouted)
KEYADC0  (3 unrouted)
LCD_D19  (3 unrouted)
LCD_D20  (3 unrouted)
LCD_D21  (3 unrouted)
LCD_D22  (3 unrouted)
LCD_D23  (3 unrouted)
LINK_LED  (1 unrouted)
MCSI-CK_N  (1 unrouted)
MCSI-CK_P  (1 unrouted)
MCSI-D0_N  (1 unrouted)
MCSI-D0_P  (1 unrouted)
MCSI-D1_N  (1 unrouted)
MCSI-D1_P  (1 unrouted)
MIC_HBIAS  (2 unrouted)
MIC_HBIAS_O  (2 unrouted)
MICIN1N  (1 unrouted)
MICIN1P  (1 unrouted)
MIPI-CSI-MCLK  (2 unrouted)
N$1  (1 unrouted)
N$3  (1 unrouted)
N$4  (1 unrouted)
N$6  (1 unrouted)
N$7  (1 unrouted)
N$8  (3 unrouted)
N$9  (1 unrouted)
N$10  (2 unrouted)
N$11  (1 unrouted)
N$12  (1 unrouted)
N$13  (2 unrouted)
N$14  (2 unrouted)
N$18  (1 unrouted)
N$20  (1 unrouted)
N$21  (4 unrouted)
N$22  (3 unrouted)
N$23  (1 unrouted)
N$26  (1 unrouted)
N$28  (2 unrouted)
N$29  (2 unrouted)
N$30  (2 unrouted)
N$32  (2 unrouted)
N$33  (2 unrouted)
N$35  (4 unrouted)
N$36  (1 unrouted)
N$41  (3 unrouted)
N$42  (3 unrouted)
N$43  (2 unrouted)
N$47  (1 unrouted)
N$48  (4 unrouted)
N$49  (4 unrouted)
N$58  (1 unrouted)
N$59  (1 unrouted)
N$60  (3 unrouted)
N$61  (1 unrouted)
N$62  (1 unrouted)
N$63  (1 unrouted)
N$69  (3 unrouted)
N$70  (1 unrouted)
N$71  (3 unrouted)
PB2  (2 unrouted)
PB3  (2 unrouted)
PB4/PWM0  (1 unrouted)
PB5/PWM1  (1 unrouted)
SDC0/CLK  (2 unrouted)
SDC0/CMD  (2 unrouted)
SDC0/D0  (2 unrouted)
SDC0/D1  (2 unrouted)
SDC0/D2  (2 unrouted)
SDC0/D3  (2 unrouted)
SDC1/CLK  (2 unrouted)
SDC1/CMD  (3 unrouted)
SDC1/D0  (3 unrouted)
SDC1/D1  (3 unrouted)
SDC1/D2  (3 unrouted)
SDC1/D3  (3 unrouted)
SPD_LED  (1 unrouted)
SPI1/CS  (3 unrouted)
SPI1/MISO  (2 unrouted)
SPI1/MOSI  (2 unrouted)
SPI1/SCK  (2 unrouted)
SVREF  (5 unrouted)
TPX1  (3 unrouted)
TPX2  (3 unrouted)
TPY1  (3 unrouted)
TPY2  (3 unrouted)
UART0/RX  (1 unrouted)
UART0/TX  (1 unrouted)
UART2/RX/PB1  (1 unrouted)
UART2/TX/PB0  (1 unrouted)
USB/ID  (2 unrouted)
USB_D_N  (2 unrouted)
USB_D_P  (2 unrouted)
V_PWR  (2 unrouted)
V_USB  (3 unrouted)
VCC-PE  (4 unrouted)
VLED+  (5 unrouted)
VLED-  (3 unrouted)
VRA1  (1 unrouted)
VRA2  (2 unrouted)
Y0_N  (1 unrouted)
Y0_P  (1 unrouted)
Y1_N  (1 unrouted)
Y1_P  (1 unrouted)
Y2_N  (1 unrouted)
Y2_P  (1 unrouted)

### Text on the board
tPlace: 1 | 1 | LVDS | EA-in1 | +3.3v | TpX2 | TpX1 | P1-Header | ACT | 1 | SN65LVDS84 | +3.3v | GND | TpY2 | TpY1 | PWR | EA-in2 | W25Q128 | 1 | NS2009 | Ethernet | +3.3v | OV2460 | VCC- / RTC | GND | CSI | RGB-1 | RGB-2 | Sunxi / V3s | 1 | 1 | USB | 1 | +VLed | GND | D1 | D0 | CLK | CMD | D3 | D2 | +3.3v | VCC / -PE | +2.5v | SDC1 | BT-UART | +5v | +5v | TxD | RxD | CTS | Mic | GND | Mic | Power | Vol+ | Vol- | Select | Start | Reset | Audio | R | WIFI / RTL8732BS | L | COM
bPlace: MIPI-CSI | BHGV / 2018 | TSC2003 | LCD | SD-Card
tNames: P1-Header | OV2460 | ACT | MIPI-CSI | PWR | SPI-Flash | Blueberry PI | OV7670 | Ethernet | SUNXI | SPFMDBC | CSI | LCD | VCC-RTC | USB | RGB | RGB | SDC1 | VCC-PE | Power | BT-UART | Vol- | Select | Start | Reset | WIFI / RTL8732BS | Vol+ | Audio
bNames: SD-Card